# EAGLE design lighthouse-v01 (EAGLE 6.3)
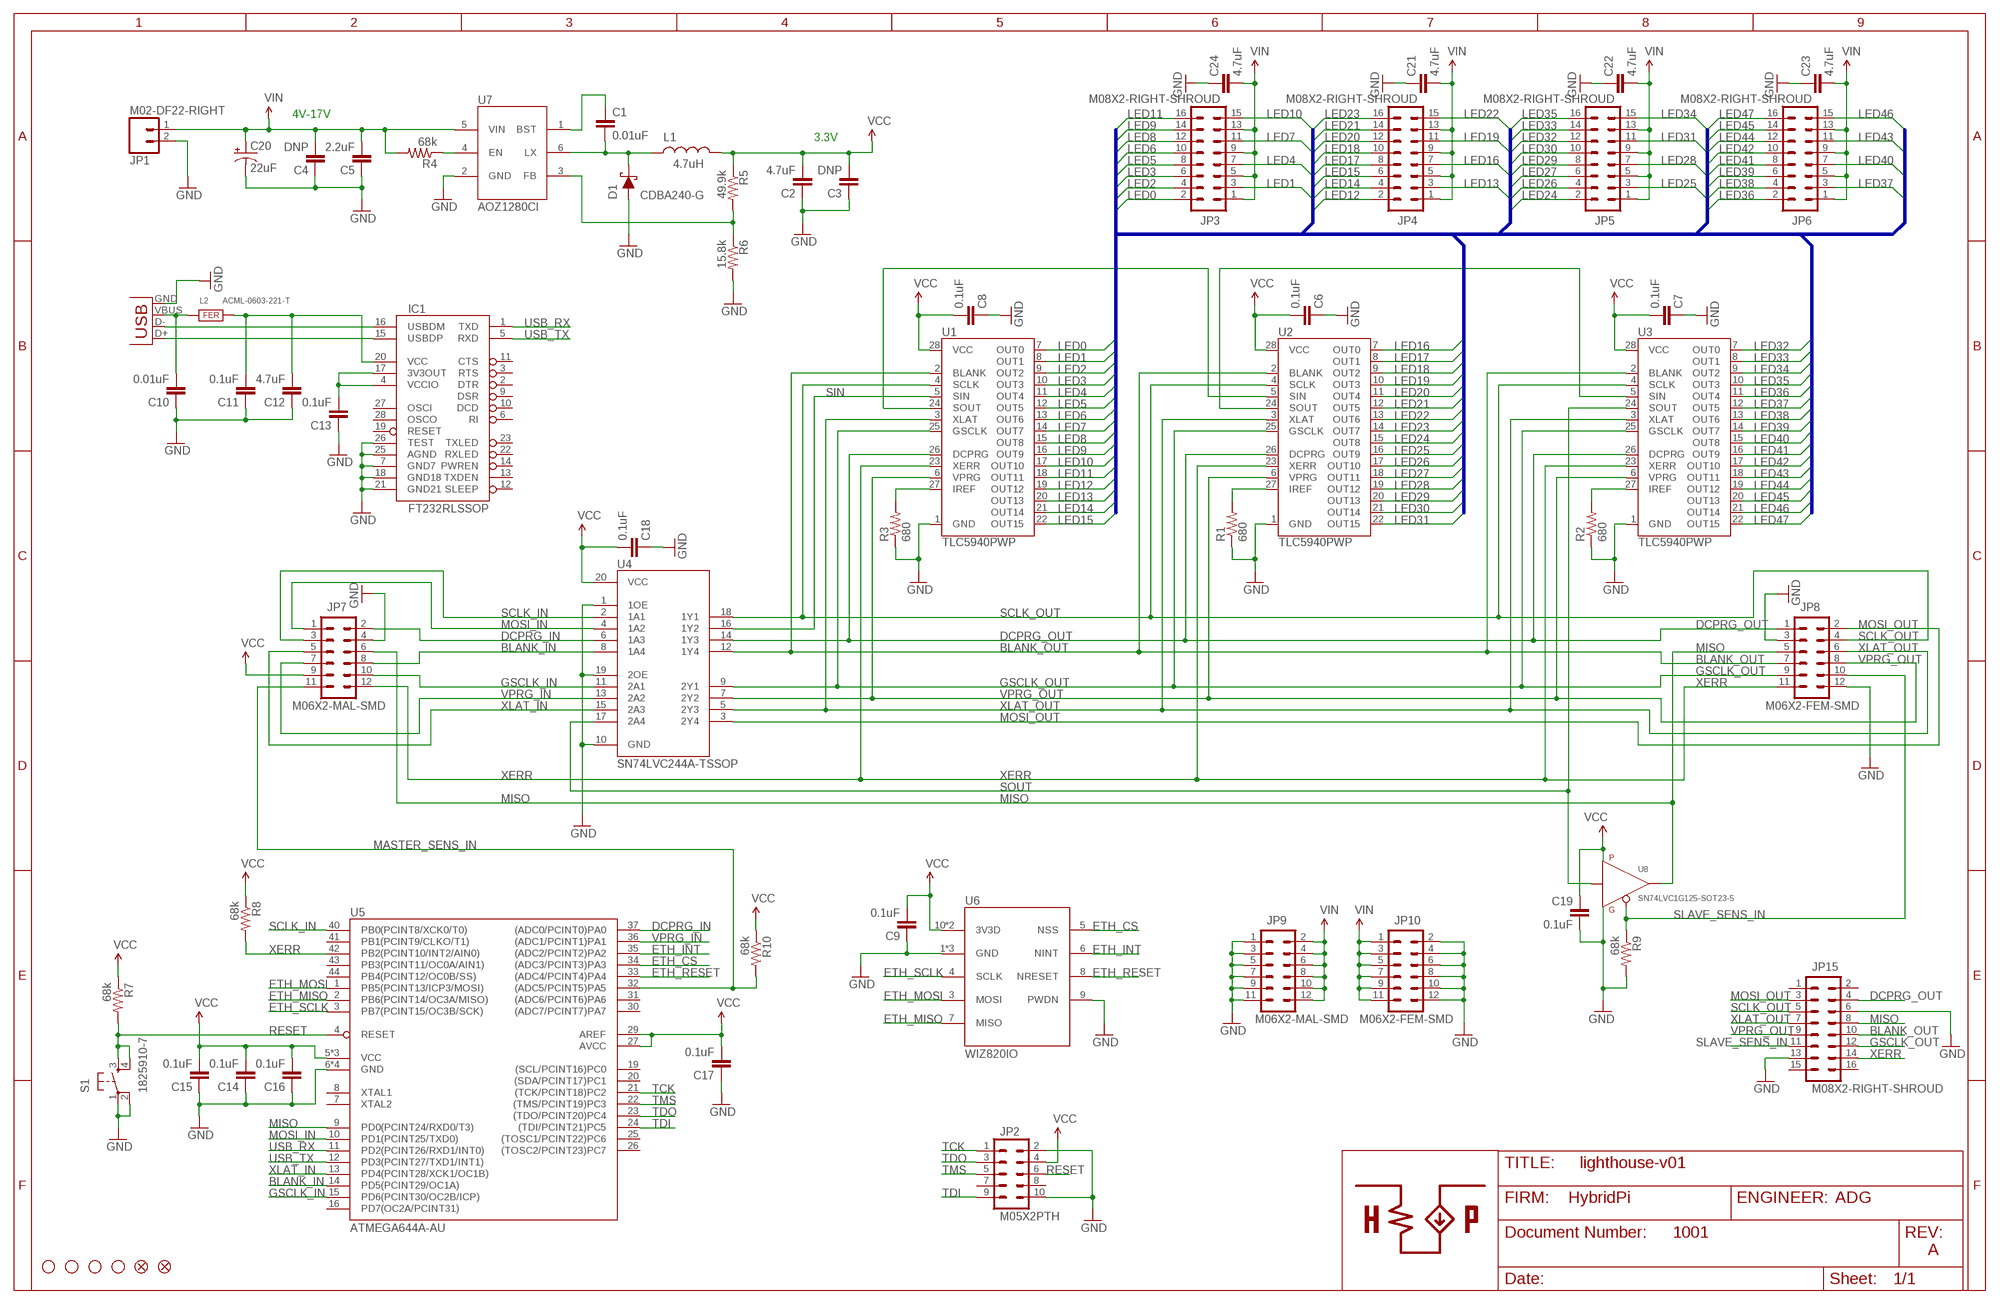
[diagram p0: schematic, sheet 1]

## Parts
C1  0.01uF  CAP0603-CAP  [0603-CAP]
C2  4.7uF  CAP0805  [0805]
C3  DNP  CAP0805  [0805]
C4  DNP  CAP0805  [0805]
C5  2.2uF  CAP0805  [0805]
C6  0.1uF  CAP0603-CAP  [0603-CAP]
C7  0.1uF  CAP0603-CAP  [0603-CAP]
C8  0.1uF  CAP0603-CAP  [0603-CAP]
C9  0.1uF  CAP0603-CAP  [0603-CAP]
C10  0.01uF  CAP0603-CAP  [0603-CAP]
C11  0.1uF  CAP0603-CAP  [0603-CAP]
C12  4.7uF  CAP0805  [0805]
C13  0.1uF  CAP0603-CAP  [0603-CAP]
C14  0.1uF  CAP0603-CAP  [0603-CAP]
C15  0.1uF  CAP0603-CAP  [0603-CAP]
C16  0.1uF  CAP0603-CAP  [0603-CAP]
C17  0.1uF  CAP0603-CAP  [0603-CAP]
C18  0.1uF  CAP0603-CAP  [0603-CAP]
C19  0.1uF  CAP0603-CAP  [0603-CAP]
C20  22uF  CAP_POLF80  [NIPPON_F80]
C21  4.7uF  CAP1206  [1206]
C22  4.7uF  CAP1206  [1206]
C23  4.7uF  CAP1206  [1206]
C24  4.7uF  CAP1206  [1206]
D1  CDBA240-G  DIODE-SCHOTTKY-SMA  [DIODE-SMA]
IC1  FT232RLSSOP  [SSOP28DB]
JP1  M02-DF22-RIGHT  [M02-DF22-RIGHT]
JP2  M05X2PTH  [AVR_ICSP]
JP3  M08X2-RIGHT-SHROUD  [2X8-RIGHT-SHROUD]
JP4  M08X2-RIGHT-SHROUD  [2X8-RIGHT-SHROUD]
JP5  M08X2-RIGHT-SHROUD  [2X8-RIGHT-SHROUD]
JP6  M08X2-RIGHT-SHROUD  [2X8-RIGHT-SHROUD]
JP7  M06X2-MAL-SMD  [2X6-SMD]
JP8  M06X2-FEM-SMD  [2X6-SMD]
JP9  M06X2-MAL-SMD  [2X6-SMD]
JP10  M06X2-FEM-SMD  [2X6-SMD]
JP11  STAND-OFF  [STAND-OFF]
JP12  STAND-OFF  [STAND-OFF]
JP13  STAND-OFF  [STAND-OFF]
JP14  STAND-OFF  [STAND-OFF]
JP15  M08X2-RIGHT-SHROUD  [2X8-RIGHT-SHROUD]
JP16  FIDUCIAL1.5X3  [FIDUCIAL-1.5X3]
JP17  FIDUCIAL1.5X3  [FIDUCIAL-1.5X3]
L1  4.7uH  INDUCTOR-SRN6045  [SRN6045]
L2  ACML-0603-221-T  FERRITE-BEAD-0603  [0603]
R1  680  RESISTOR0603-RES  [0603-RES]
R2  680  RESISTOR0603-RES  [0603-RES]
R3  680  RESISTOR0603-RES  [0603-RES]
R4  68k  RESISTOR0603-RES  [0603-RES]
R5  49.9k  RESISTOR0603-RES  [0603-RES]
R6  15.8k  RESISTOR0603-RES  [0603-RES]
R7  68k  RESISTOR0603-RES  [0603-RES]
R8  68k  RESISTOR0603-RES  [0603-RES]
R9  68k  RESISTOR0603-RES  [0603-RES]
R10  68k  RESISTOR0603-RES  [0603-RES]
S1  1825910-7  TAC_SWITCHPTH  [TACTILE-PTH]
U1  TLC5940PWP  [TSSOP28-GROUNDPAD]
U2  TLC5940PWP  [TSSOP28-GROUNDPAD]
U3  TLC5940PWP  [TSSOP28-GROUNDPAD]
U4  SN74LVC244A-TSSOP  [TSSOP-20]
U5  ATMEGA644A-AU  [TQFP-44]
U6  WIZ820IO  [WIZ820IO]
U7  AOZ1280CI  [SOT23-6]
U8  SN74LVC1G125-SOT23-5  [SOT23-5]
X1  USBSMD  [USB-MINIB]

## Nets
BLANK_IN: JP7.8 U4.8(1A4) U5.14(PD5(PCINT29/OC1A))
BLANK_OUT: JP8.7 JP15.10 U1.2(BLANK) U2.2(BLANK) U3.2(BLANK) U4.12(1Y4)
DCPRG_IN: JP7.2 U4.6(1A3) U5.37((ADC0/PCINT0)PA0)
DCPRG_OUT: JP8.1 JP15.4 U1.26(DCPRG) U2.26(DCPRG) U3.26(DCPRG) U4.14(1Y3)
ETH_CS: U5.34((ADC3/PCINT3)PA3) U6.5(NSS)
ETH_INT: U5.35((ADC2/PCINT2)PA2) U6.6(NINT)
ETH_MISO: U5.2(PB6(PCINT14/OC3A/MISO)) U6.7(MISO)
ETH_MOSI: U5.1(PB5(PCINT13/ICP3/MOSI)) U6.3(MOSI)
ETH_RESET: U5.33((ADC4/PCINT4)PA4) U6.8(NRESET)
ETH_SCLK: U5.3(PB7(PCINT15/OC3B/SCK)) U6.4(SCLK)
GND: C2.1 C3.1 C4.1 C5.1 C6.1 C7.1 C8.1 C9.1 C10.1 C11.1 C12.1 C13.1 C14.1 C15.1 C16.1 C17.1 C18.1 C19.2 C20.- C21.1 C22.1 C23.1 C24.1 D1.A IC1.7(GND7) IC1.18(GND18) IC1.21(GND21) IC1.25(AGND) IC1.26(TEST) JP1.2 JP2.2 JP2.10 JP7.4 JP8.3 JP8.12 JP9.1 JP9.3 JP9.5 JP9.7 JP9.9 JP9.11 JP10.2 JP10.4 JP10.6 JP10.8 JP10.10 JP10.12 JP15.6 JP15.13 R1.1 R2.1 R3.1 R6.2 R9.2 S1.1 S1.2 U1.1(GND) U2.1(GND) U3.1(GND) U4.1(1OE) U4.10(GND) U4.19(2OE) U5.6(GND) U5.18(GND) U5.28(GND) U5.39(GND) U6.1(GND) U6.2(GND) U6.9(PWDN) U6.12(GND) U7.2(GND) U8.3(GND) X1.GND
GSCLK_IN: JP7.10 U4.11(2A1) U5.15(PD6(PCINT30/OC2B/ICP))
GSCLK_OUT: JP8.9 JP15.12 U1.25(GSCLK) U2.25(GSCLK) U3.25(GSCLK) U4.9(2Y1)
LED0: JP3.2 U1.7(OUT0)
LED1: JP3.3 U1.8(OUT1)
LED2: JP3.4 U1.9(OUT2)
LED3: JP3.6 U1.10(OUT3)
LED4: JP3.7 U1.11(OUT4)
LED5: JP3.8 U1.12(OUT5)
LED6: JP3.10 U1.13(OUT6)
LED7: JP3.11 U1.14(OUT7)
LED8: JP3.12 U1.15(OUT8)
LED9: JP3.14 U1.16(OUT9)
LED10: JP3.15 U1.17(OUT10)
LED11: JP3.16 U1.18(OUT11)
LED12: JP4.2 U1.19(OUT12)
LED13: JP4.3 U1.20(OUT13)
LED14: JP4.4 U1.21(OUT14)
LED15: JP4.6 U1.22(OUT15)
LED16: JP4.7 U2.7(OUT0)
LED17: JP4.8 U2.8(OUT1)
LED18: JP4.10 U2.9(OUT2)
LED19: JP4.11 U2.10(OUT3)
LED20: JP4.12 U2.11(OUT4)
LED21: JP4.14 U2.12(OUT5)
LED22: JP4.15 U2.13(OUT6)
LED23: JP4.16 U2.14(OUT7)
LED24: JP5.2 U2.15(OUT8)
LED25: JP5.3 U2.16(OUT9)
LED26: JP5.4 U2.17(OUT10)
LED27: JP5.6 U2.18(OUT11)
LED28: JP5.7 U2.19(OUT12)
LED29: JP5.8 U2.20(OUT13)
LED30: JP5.10 U2.21(OUT14)
LED31: JP5.11 U2.22(OUT15)
LED32: JP5.12 U3.7(OUT0)
LED33: JP5.14 U3.8(OUT1)
LED34: JP5.15 U3.9(OUT2)
LED35: JP5.16 U3.10(OUT3)
LED36: JP6.2 U3.11(OUT4)
LED37: JP6.3 U3.12(OUT5)
LED38: JP6.4 U3.13(OUT6)
LED39: JP6.6 U3.14(OUT7)
LED40: JP6.7 U3.15(OUT8)
LED41: JP6.8 U3.16(OUT9)
LED42: JP6.10 U3.17(OUT10)
LED43: JP6.11 U3.18(OUT11)
LED44: JP6.12 U3.19(OUT12)
LED45: JP6.14 U3.20(OUT13)
LED46: JP6.15 U3.21(OUT14)
LED47: JP6.16 U3.22(OUT15)
MASTER_SENS_IN: JP7.11 R10.2 U5.32((ADC5/PCINT5)PA5)
MISO: JP7.6 JP8.5 JP15.8 U5.9(PD0(PCINT24/RXD0/T3)) U8.4(Y)
MOSI_IN: JP7.1 U4.4(1A2) U5.10(PD1(PCINT25/TXD0))
MOSI_OUT: JP8.2 JP15.3 U4.3(2Y4)
N$1: R3.2 U1.27(IREF)
N$2: R1.2 U2.27(IREF)
N$5: U2.24(SOUT) U3.5(SIN)
N$7: C1.1 U7.1(BST)
N$8: C1.2 D1.C L1.1 U7.6(LX)
N$11: R5.2 R6.1 U7.3(FB)
N$13: R4.1 U7.4(EN)
N$14: C10.2 L2.1 X1.VBUS
N$15: C11.2 C12.2 IC1.20(VCC) L2.2
N$16: IC1.16(USBDM) X1.D-
N$17: IC1.15(USBDP) X1.D+
N$18: C13.2 IC1.4(VCCIO) IC1.17(3V3OUT)
N$19: R2.2 U3.27(IREF)
N$24: U1.24(SOUT) U2.5(SIN)
RESET: JP2.6 R7.2 S1.3 S1.4 U5.4(RESET)
SCLK_IN: JP7.3 U4.2(1A1) U5.40(PB0(PCINT8/XCK0/T0))
SCLK_OUT: JP8.4 JP15.5 U1.4(SCLK) U2.4(SCLK) U3.4(SCLK) U4.18(1Y1)
SIN: U1.5(SIN) U4.16(1Y2)
SLAVE_SENS_IN: JP8.10 JP15.11 R9.1 U8.1(OE)
SOUT: U3.24(SOUT) U4.17(2A4) U8.2(A)
TCK: JP2.1 U5.21((TCK/PCINT18)PC2)
TDI: JP2.9 U5.24((TDI/PCINT21)PC5)
TDO: JP2.3 U5.23((TDO/PCINT20)PC4)
TMS: JP2.5 U5.22((TMS/PCINT19)PC3)
USB_RX: IC1.1(TXD) U5.11(PD2(PCINT26/RXD1/INT0))
USB_TX: IC1.5(RXD) U5.12(PD3(PCINT27/TXD1/INT1))
VCC: C2.2 C3.2 C6.2 C7.2 C8.2 C9.2 C14.2 C15.2 C16.2 C17.2 C18.2 C19.1 JP2.4 JP7.9 L1.2 R5.1 R7.1 R8.1 R10.1 U1.28(VCC) U2.28(VCC) U3.28(VCC) U4.20(VCC) U5.5(VCC) U5.17(VCC) U5.27(AVCC) U5.29(AREF) U5.38(VCC) U6.10(3V3D) U6.11(3V3D) U8.5(VCC)
VIN: C4.2 C5.2 C20.+ C21.2 C22.2 C23.2 C24.2 JP1.1 JP3.1 JP3.5 JP3.9 JP3.13 JP4.1 JP4.5 JP4.9 JP4.13 JP5.1 JP5.5 JP5.9 JP5.13 JP6.1 JP6.5 JP6.9 JP6.13 JP9.2 JP9.4 JP9.6 JP9.8 JP9.10 JP9.12 JP10.1 JP10.3 JP10.5 JP10.7 JP10.9 JP10.11 R4.2 U7.5(VIN)
VPRG_IN: JP7.7 U4.13(2A2) U5.36((ADC1/PCINT1)PA1)
VPRG_OUT: JP8.8 JP15.9 U1.6(VPRG) U2.6(VPRG) U3.6(VPRG) U4.7(2Y2)
XERR: JP7.12 JP8.11 JP15.14 R8.2 U1.23(XERR) U2.23(XERR) U3.23(XERR) U5.42(PB2(PCINT10/INT2/AIN0))
XLAT_IN: JP7.5 U4.15(2A3) U5.13(PD4(PCINT28/XCK1/OC1B))
XLAT_OUT: JP8.6 JP15.7 U1.3(XLAT) U2.3(XLAT) U3.3(XLAT) U4.5(2Y3)
Unconnected: IC1.2(DTR) IC1.3(RTS) IC1.6(RI) IC1.9(DSR) IC1.10(DCD) IC1.11(CTS) IC1.12(SLEEP) IC1.13(TXDEN) IC1.14(PWREN) IC1.19(RESET) IC1.22(RXLED) IC1.23(TXLED) IC1.27(OSCI) IC1.28(OSCO) JP2.7 JP2.8 JP15.1 JP15.2 JP15.15 JP15.16 U5.7(XTAL2) U5.8(XTAL1) U5.16(PD7(OC2A/PCINT31)) U5.19((SCL/PCINT16)PC0) U5.20((SDA/PCINT17)PC1) U5.25((TOSC1/PCINT22)PC6) U5.26((TOSC2/PCINT23)PC7) U5.30((ADC7/PCINT7)PA7) U5.31((ADC6/PCINT6)PA6) U5.41(PB1(PCINT9/CLKO/T1)) U5.43(PB3(PCINT11/OC0A/AIN1)) U5.44(PB4(PCINT12/OC0B/SS))

## Buses
LED[0..47]

## Notes on the sheet
- 4V-17V
- 3.3V
- ADG
- 1001
- A

## Library data of the parts
C1 C6-C11 C13-C19 = SparkFun:CAP: Capacitor Standard 0603 ceramic capacitor, and 0.1" leaded capacitor.; EAGLEUP: C0603
C2-C5 = SparkFun:CAP: Capacitor Standard 0603 ceramic capacitor, and 0.1" leaded capacitor.; EAGLEUP: C0805
C12 = SparkFun-Passives:CAP: Capacitor Standard 0603 ceramic capacitor, and 0.1" leaded capacitor.; EAGLEUP: C0603
C20 = SparkFun-Passives:CAP_POL: Capacitor Polarized These are standard SMD and PTH capacitors. Normally 10uF, 47uF, and 100uF in electrolytic and tantalum varieties. Always verify the external diameter of the through hole cap, it varies with capacity, voltage, and manufacturer. The EIA devices should be standard.; EAGLEUP: CAE-NIPPON-F80
C21-C24 = SparkFun-Passives:CAP: Capacitor Standard 0603 ceramic capacitor, and 0.1" leaded capacitor.; EAGLEUP: C1206
D1 = hybridpi:DIODE-SCHOTTKY: Schottky Diode SMA/B Package Example Datasheet: B1X0(B) <http://www.diodes.com/datasheets/ds13002.pdf>; EAGLEUP: DIODE-SMA
IC1 = SparkFun:FT232RL: USB UART FT232RL 4th Generation USB UART (USB <-> Serial) Controller. Spark Fun Electronics SKU : COM-00650; EAGLEUP: SSOP-28
JP1 = hybridpi:M02: 2 Position Connector DF22-Right 15A: DF22-2P-7.92DS(05) <http://www.hirose.co.jp/cataloge_hp/e68010003.pdf>; EAGLEUP: M02-DF22-RIGHT
JP2 = SparkFun-Connectors:M05X2: Header 5x2 Standard 10-pin dual row 0.1" header. Commonly used with AVR-ISP. Use with Spark Fun Electronics SKU: PRT-00778; EAGLEUP: M05X2
JP3-JP6 JP15 = hybridpi:M08X2: 8x2 0.1" Header M08X2-RIGHT-SHROUD: 302-R165 <http://www.on-shore.com/sites/default/files/manuals/302-rxxx.pdf>; EAGLEUP: M08X2-RIGHT-SHROUD
JP7 JP9 = hybridpi:M06X2: 0.1" Header 6x2 SMD Female Package: NPTC062KFMS-RC <http://www.sullinscorp.com/drawings/103_NPxCxx2KFMx-RC,_10488-G.pdf> SMD Male Package: 15-91-2120 <http://www.molex.com/pdm_docs/sd/015912120_sd.pdf>; EAGLEUP: M06X2-MAL-SMD
JP8 JP10 = hybridpi:M06X2: 0.1" Header 6x2 SMD Female Package: NPTC062KFMS-RC <http://www.sullinscorp.com/drawings/103_NPxCxx2KFMx-RC,_10488-G.pdf> SMD Male Package: 15-91-2120 <http://www.molex.com/pdm_docs/sd/015912120_sd.pdf>; EAGLEUP: M06X2-FEM-SMD
JP11-JP14 = SparkFun-Electromechanical:STAND-OFF: #4 Stand Off This is the mechanical footprint for a #4 phillips button head screw. Use the keepout ring to avoid running the screw head into surrounding components. SKU : PRT-00447
JP16 JP17 = SparkFun-Aesthetics:FIDUCIAL: Fiducial Alignment Points Various fiducial points for machine vision alignment.
L1 = hybridpi:INDUCTOR: Inductor SRN6045: Datasheet <http://www.bourns.com/data/global/pdfs/SRN6045.pdf>; EAGLEUP: SRN6045
L2 = ADG:FERRITE-BEAD
R1-R10 = SparkFun:RESISTOR: Resistor Basic schematic elements and footprints for 0603, 1206, and PTH resistors.; EAGLEUP: R0603
S1 = SparkFun-Electromechanical:TAC_SWITCH: Momentary Switch Button commonly used for reset or general input. Spark Fun Electronics SKU : COM-00097; EAGLEUP: TACTILE-PTH
U1-U3 = SparkFun:TLC5940: TI TLC5940 16-channel LED Driver with Dot Correction and Grayscale PWM Control The TLC5940 is a 16-channel, constant-current sink LED driver. Each channel has an individually adjustable 4096-step grayscale PWM brightness control and a 64-step, constant-current sink (dot correction). The dot correction adjusts the brightness variations between LED channels and other LED drivers. The dot correction data is stored in an integrated EEPROM. Both grayscale control and dot correction are accessible via a serial interface. A single external resistor sets the maximum current value of all 16 channels. Packages: 28-pin HTSSOP 32-pin 5x5mm QFN 28-pin DIP; EAGLEUP: TSSOP-28
U4 = hybridpi:SN74LVC244A: High Speed Tri-State Buffer Texas Instruments Datasheet: SN74LVC244A <http://www.ti.com/lit/ds/symlink/sn74lvc244a.pdf>; EAGLEUP: TSSOP-20
U5 = hybridpi:ATMEGA644A: 8-BIT 20MHz MCU Atmel 32 I/O Datasheet: ATMEGAXX(X)4A(P) <http://www.atmel.com/Images/doc8272.pdf>; EAGLEUP: TQFP-44
U6 = hybridpi:WIZ820IO: Ethernet to SPI Communication Module WIZnet Datasheet: WIZ820io <http://www.wiznet.co.kr/include_Files/Just_Download.asp?PK_NUM=463&file_local_path=ReferenceFiles&file_local_name=WIZ820io_User_Manual_V1.0.pdf>; EAGLEUP: WIZ820IO
U7 = hybridpi:AOZ1280CI: 1.2A Buck Regulator w/Internal Power Switch Datasheet: AOZ1280CI <http://www.aosmd.com/res/data_sheets/AOZ1280CI.pdf>; EAGLEUP: SOT23-6
U8 = hybridpi:SN74LVC1G125: Tri-State Buffer Texas Instruments SOT23-5: 74LVC1G125 <http://www.ti.com/lit/ds/symlink/sn74lvc1g125.pdf>; EAGLEUP: SOT23-5
X1 = SparkFun:USB: USB Connectors USB-B-PTH is fully proven SKU : PRT-00139 USB-miniB is fully proven SKU : PRT-00587 USB-A-PCB is untested. USB-A-H is throughly reviewed, but untested. Spark Fun Electronics SKU : PRT-00437 USB-B-SMT is throughly reviewed, but untested. Needs silkscreen touching up. USB-A-S has not been used/tested USB-MB-H has not been used/tested

## Board
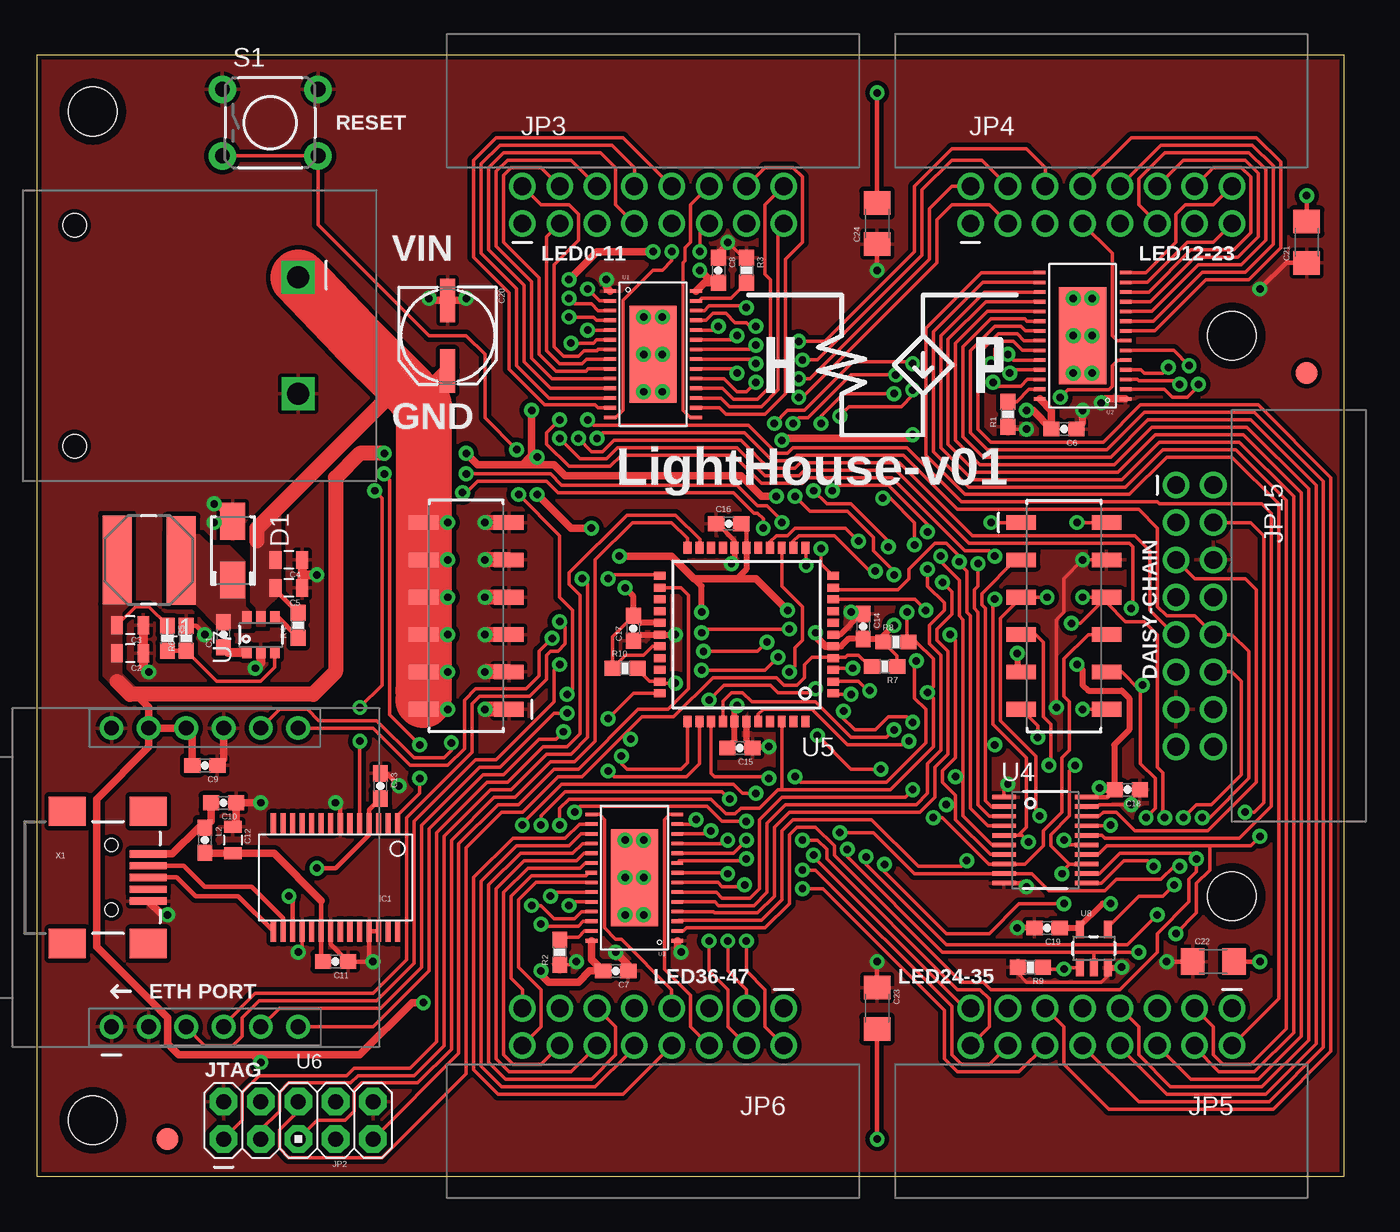
[diagram p1: board, top side]
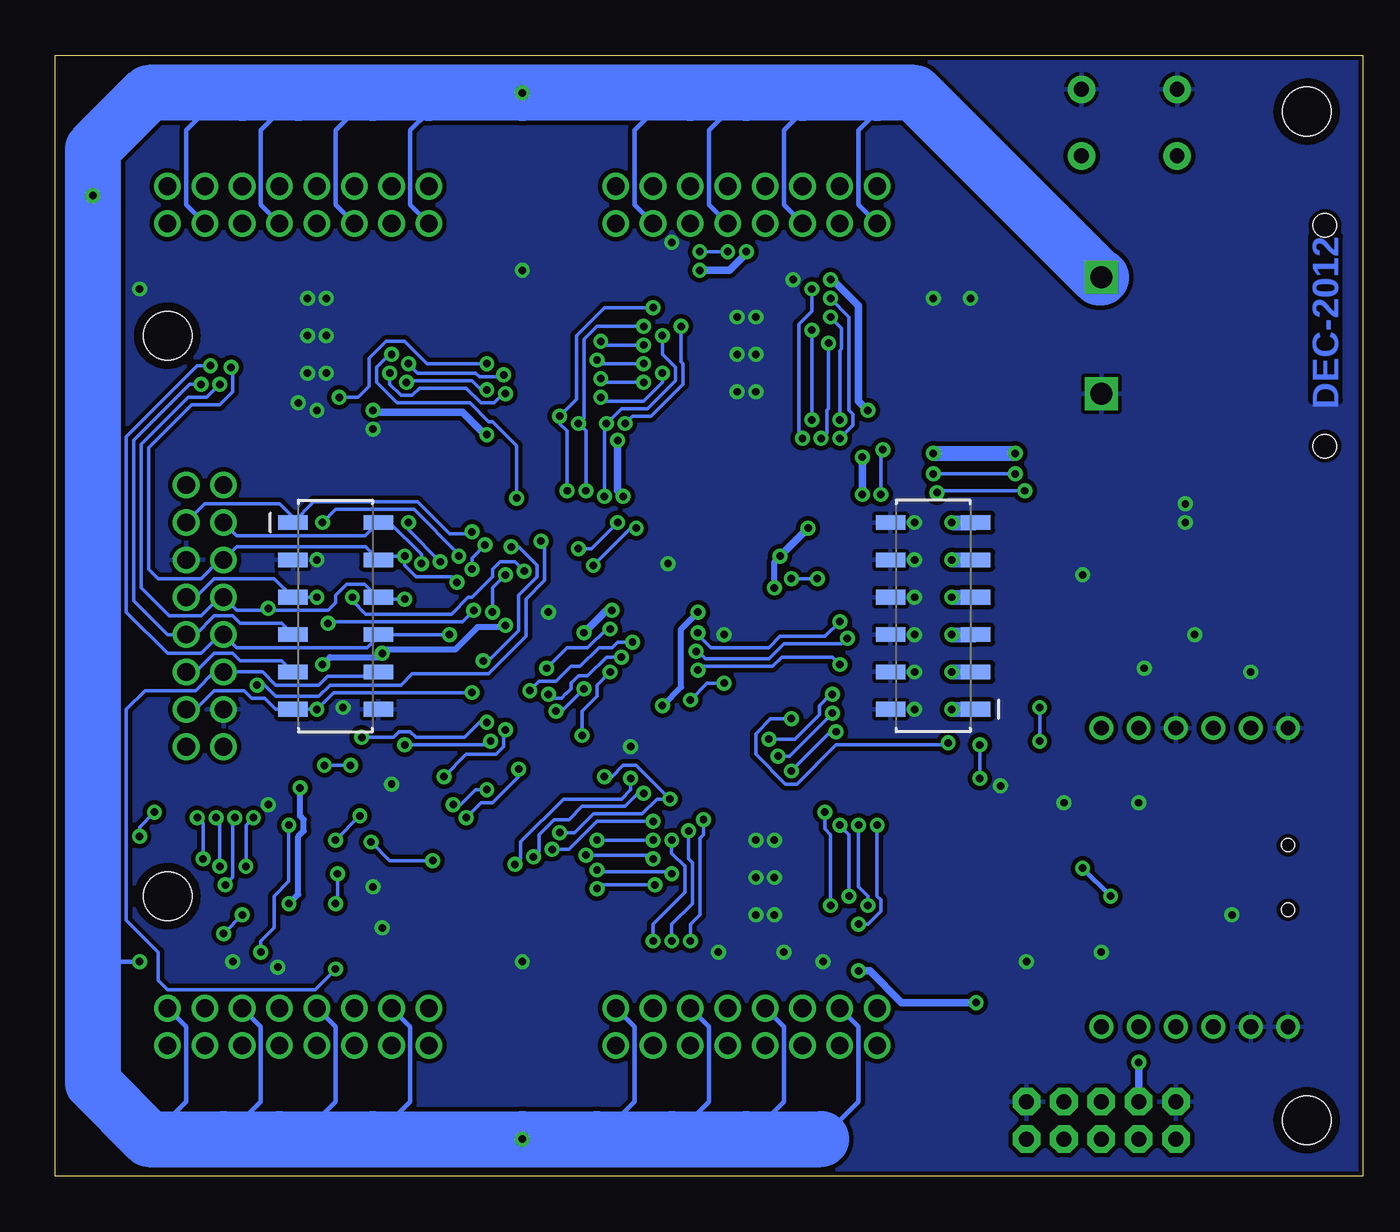
[diagram p2: board, bottom side, seen from below]

Size 88.9 x 76.2 mm. Coordinates in mm from the lower left corner, seen from the top.
Outline: 0,0 88.9,0 88.9,76.2 0,76.2 0,0
Copper layers (1*16): Top 0.035mm / dielectric 1.5mm / Bottom 0.035mm
Design rules "SparkFun": minimum track width 8mil, minimum drill 20mil, track to track 8mil, track to pad 8mil, pad to pad 8mil, via to via 8mil, smd to smd 8mil, copper to edge 10mil, drill to drill 8mil, minimum pad ring 12mil, minimum via ring 10mil, stop-mask expansion 4mil, vias tented up to drill 25mil, thermal gap 10mil

### Footprints (pad centres in the part's own frame; a part is rotated, then mirrored left to right if it is on the bottom)
0603-CAP = smd 1.1 x 1: 1 -0.85,0; 2 0.85,0
0805 = smd 0.8 x 1.2: 1 -0.9,0; 2 0.9,0
NIPPON_F80 = smd 2.95 x 1: + 2.4,0; - -2.4,0
1206 = smd 1.6 x 1.8: 1 -1.4,0; 2 1.4,0
DIODE-SMA = smd 2.5 x 1.7: A -2,0; C 2,0
SSOP28DB = smd 0.348 x 1.397: 1 -4.225,-3.656; 2 -3.575,-3.656; 3 -2.925,-3.656; 4 -2.275,-3.656; 5 -1.625,-3.656; 6 -0.975,-3.656; 7 -0.325,-3.656; 8 0.325,-3.656; 9 0.975,-3.656; 10 1.625,-3.656; 11 2.275,-3.656; 12 2.925,-3.656; 13 3.575,-3.656; 14 4.225,-3.656; 15 4.225,3.656; 16 3.575,3.656; 17 2.925,3.656; 18 2.275,3.656; 19 1.625,3.656; 20 0.975,3.656; 21 0.325,3.656; 22 -0.325,3.656; 23 -0.975,3.656; 24 -1.625,3.656; 25 -2.275,3.656; 26 -2.925,3.656; 27 -3.575,3.656; 28 -4.225,3.656
M02-DF22-RIGHT = drill 1.5 square: 1 3.96,0; 2 -3.96,0 | hole 1.6: -7.5,15.2; 7.5,15.2
AVR_ICSP = drill 1.016 pad 1.88 octagon: 1 -1.27,5.08; 2 1.27,5.08; 3 -1.27,2.54; 4 1.27,2.54; 5 -1.27,0; 6 1.27,0; 7 -1.27,-2.54; 8 1.27,-2.54; 9 -1.27,-5.08; 10 1.27,-5.08
2X8-RIGHT-SHROUD = drill 1.2: 1 -8.89,0; 2 -8.89,2.54; 3 -6.35,0; 4 -6.35,2.54; 5 -3.81,0; 6 -3.81,2.54; 7 -1.27,0; 8 -1.27,2.54; 9 1.27,0; 10 1.27,2.54; 11 3.81,0; 12 3.81,2.54; 13 6.35,0; 14 6.35,2.54; 15 8.89,0; 16 8.89,2.54
2X6-SMD = smd 1 x 2: 1 6.35,2.896; 2 6.35,-2.896; 3 3.81,2.896; 4 3.81,-2.896; 5 1.27,2.896; 6 1.27,-2.896; 7 -1.27,2.896; 8 -1.27,-2.896; 9 -3.81,2.896; 10 -3.81,-2.896; 11 -6.35,2.896; 12 -6.35,-2.896
STAND-OFF = hole 3.302: 0,0
FIDUCIAL-1.5X3 = smd 1.5 x 1.5: 1 0,0
SRN6045 = smd 2 x 6: 1 -2.2,0.05; 2 2.15,0
0603 = smd 1.1 x 1: 1 -0.85,0; 2 0.85,0
0603-RES = smd 1.1 x 1: 1 -0.85,0; 2 0.85,0
TACTILE-PTH = drill 1.016 pad 1.88: 1 -3.251,2.261; 2 3.251,2.261; 3 -3.251,-2.261; 4 3.251,-2.261
TSSOP28-GROUNDPAD = smd 0.8 x 0.25: 1 -2.921,4.298; 2 -2.921,3.637; 3 -2.921,2.977; 4 -2.921,2.317; 5 -2.921,1.656; 6 -2.921,0.996; 7 -2.921,0.335; 8 -2.927,-0.325; 9 -2.921,-0.985; 10 -2.921,-1.646; 11 -2.921,-2.306; 12 -2.921,-2.967; 13 -2.921,-3.627; 14 -2.921,-4.287; 15 2.921,-4.287; 16 2.921,-3.627; 17 2.921,-2.967; 18 2.921,-2.306; 19 2.921,-1.646; 20 2.921,-0.985; 21 2.927,-0.325; 22 2.921,0.335; 23 2.921,0.996; 24 2.921,1.656; 25 2.921,2.317; 26 2.921,2.977; 27 2.921,3.637; 28 2.921,4.298 | smd 3.2 x 6.6: 29 0,0.005
TSSOP-20 = smd 0.3 x 1.6: 1 -2.925,-2.8; 2 -2.275,-2.8; 3 -1.625,-2.8; 4 -0.975,-2.8; 5 -0.325,-2.8; 6 0.325,-2.8; 7 0.975,-2.8; 8 1.625,-2.8; 9 2.275,-2.8; 10 2.925,-2.8; 11 2.925,2.8; 12 2.275,2.8; 13 1.625,2.8; 14 0.975,2.8; 15 0.325,2.8; 16 -0.325,2.8; 17 -0.975,2.8; 18 -1.625,2.8; 19 -2.275,2.8; 20 -2.925,2.8
TQFP-44 = smd 0.8 x 0.54: 1 -5.9,4; 2 -5.9,3.2; 3 -5.9,2.4; 4 -5.9,1.6; 5 -5.9,0.8; 6 -5.9,0; 7 -5.9,-0.8; 8 -5.9,-1.6; 9 -5.9,-2.4; 10 -5.9,-3.2; 11 -5.9,-4; 23 5.9,-4; 24 5.9,-3.2; 25 5.9,-2.4; 26 5.9,-1.6; 27 5.9,-0.8; 28 5.9,0; 29 5.9,0.8; 30 5.9,1.6; 31 5.9,2.4; 32 5.9,3.2; 33 5.9,4 | smd 0.54 x 0.8: 12 -4,-5.9; 13 -3.2,-5.9; 14 -2.4,-5.9; 15 -1.6,-5.9; 16 -0.8,-5.9; 17 0,-5.9; 18 0.8,-5.9; 19 1.6,-5.9; 20 2.4,-5.9; 21 3.2,-5.9; 22 4,-5.9; 34 4,5.9; 35 3.2,5.9; 36 2.4,5.9; 37 1.6,5.9; 38 0.8,5.9; 39 0,5.9; 40 -0.8,5.9; 41 -1.6,5.9; 42 -2.4,5.9; 43 -3.2,5.9; 44 -4,5.9
WIZ820IO = drill 1.016: 1 -10.16,6.35; 2 -10.16,3.81; 3 -10.16,1.27; 4 -10.16,-1.27; 5 -10.16,-3.81; 6 -10.16,-6.35; 7 10.16,-6.35; 8 10.16,-3.81; 9 10.16,-1.27; 10 10.16,1.27; 11 10.16,3.81; 12 10.16,6.35
SOT23-6 = smd 0.63 x 0.8: 1 -0.95,-1.2; 2 0,-1.2; 3 0.95,-1.2; 4 0.95,1.2; 5 0,1.2; 6 -0.95,1.2
SOT23-5 = smd 0.55 x 1.2: 1 -0.95,-1.3; 2 0,-1.3; 3 0.95,-1.3; 4 0.95,1.3; 5 -0.95,1.3
USB-MINIB = smd 2.5 x 0.5: D+ 2.5,0; D- 2.5,0.8; GND 2.5,-1.6; ID 2.5,-0.8; VBUS 2.5,1.6 | smd 2.5 x 2: MTN1 -3,4.5; MTN2 2.5,4.5; MTN3 -3,-4.5; MTN4 2.5,-4.5 | hole 0.9: 0,2.2; 0,-2.2

### Placement (x,y rotation side)
C1  12.7,36.83 90 top
C2  6.35,35.56 180 top
C3  6.35,37.47 180 top
C4  17.14,41.91 180 top
C5  17.14,40.01 180 top
C6  69.85,50.8 180 top
C7  39.37,13.97 180 top
C8  46.35,61.59 270 top
C9  11.43,27.94 180 top
C10  12.7,25.4 180 top
C11  20.32,14.61 180 top
C12  13.34,22.86 270 top
C13  23.37,26.54 270 top
C14  56.2,37.38 270 top
C15  47.82,29.13 180 top
C16  47.05,44.37 0 top
C17  40.58,37.26 90 top
C18  74.17,26.29 180 top
C19  68.71,16.89 180 top
C20  27.94,57.15 270 top
C21  86.36,63.5 90 top
C22  80.01,14.61 0 top
C23  57.15,11.43 270 top
C24  57.15,64.77 90 top
D1  13.34,42.55 270 top
IC1  20.32,20.32 180 top
JP1  17.78,57.15 90 top
JP2  17.78,3.81 90 top
JP3  41.91,64.77 0 top
JP4  72.39,64.77 0 top
JP5  72.39,11.43 180 top
JP6  41.91,11.43 180 top
JP7  69.85,38.1 90 top
JP8  69.85,38.1 90 bottom
JP9  29.21,38.1 270 top
JP10  29.21,38.1 270 bottom
JP11  81.28,57.15 0 top
JP12  81.28,19.05 0 top
JP13  3.81,3.81 0 top
JP14  3.81,72.39 0 top
JP15  77.47,38.1 270 top
JP16  8.89,2.54 0 top
JP17  86.36,54.61 0 top
L1  7.62,41.91 180 top
L2  11.43,22.86 270 top
R1  66.04,51.82 90 top
R2  35.56,15.24 90 top
R3  48.26,61.59 270 top
R4  17.78,37.47 90 top
R5  8.89,36.58 270 top
R6  10.16,36.58 90 top
R7  57.66,34.67 180 top
R8  58.42,36.32 0 top
R9  67.56,14.22 180 top
R10  40.01,34.54 0 top
S1  15.88,71.63 0 top
U1  41.91,55.88 0 top
U2  71.12,57.15 180 top
U3  40.64,20.32 180 top
U4  68.58,22.86 270 top
U5  48.26,36.83 180 top
U6  11.43,20.32 90 top
U7  15.24,36.83 0 top
U8  71.88,15.49 0 top
U$9  [HYBRIDPI_LOGO_MED]  48.26,50.29 0 top
X1  5.08,20.32 0 top

### Tracks (layer width: path | path; a pad name or v marks a point on that pad's centre or on a via)
BLANK_IN  (via drill 0.51)
  Top 0.254: JP7.8 71.5,36.83 69.85,35.18 69.85,32.64 70.23,32.26 70.23,28.96 69.72,28.45 69.72,24.77 68.45,23.5 68.45,22.48 67.21,21.23 U4.8 64.74,21.23 61.59,24.38 v60.96,24.38 | v53.09,29.97 55.37,27.69 v57.4,27.69 | U5.14 50.67,42.72 50.67,40.13 52.07,38.73 52.07,36.45 51.56,35.94 51.56,34.67 v51.18,34.29
  Bottom 0.254: v51.18,34.29 52.07,33.4 52.07,32.64 53.09,31.62 v53.09,29.97 | v60.96,24.38 59.94,25.4 59.18,25.4 57.4,27.18 v57.4,27.69
BLANK_OUT  (via drill 0.51)
  Top 0.254: U1.2 38.27,59.52 v37.47,60.33 | U3.2 43.99,16.68 44.2,16.89 49.53,16.89 51.18,18.54 51.18,23.24 51.69,23.75 52.96,23.75 54.23,22.48 54.23,21.84 62.87,13.21 64.39,13.21 64.9,12.7 73.66,12.7 76.2,15.24 76.2,16.51 78.36,18.67 78.36,20.19 78.87,20.7 v78.87,21.59 78.49,21.97 73.66,21.97 72.27,20.59 U4.12 | U2.2 76.66,53.51 77.22,52.96 78.23,52.96 78.99,53.72 v78.99,53.85 | v38.1,50.16 38.48,50.55 48.13,50.55 50.04,48.64 51.31,48.64 51.69,49.02 58.93,49.02 62.61,45.34 74.93,45.34 76.2,44.07 76.2,38.73 76.83,38.1 78.74,38.1 JP15.10 81.28,36.83 82.42,35.69 82.42,27.05 79.76,24.38 v79.25,24.38
  Bottom 0.254: v37.47,60.33 37.47,58.8 38.35,57.91 38.35,50.42 v38.1,50.16 | v78.99,53.85 79.76,53.85 83.57,50.04 83.57,39.12 81.28,36.83 JP15.10 79.38,36.83 78.11,38.1 76.83,38.1 76.33,37.59 73.51,37.59 JP8.7 | v78.87,21.59 78.87,24 v79.25,24.38
DCPRG_IN  (via drill 0.51)
  Top 0.254: v70.74,44.45 JP7.2 | U4.6 64.97,22.54 62.99,24.51 62.99,27.18 | 62.99,27.18 62.99,37.85 62.74,38.1 62.74,40.51 61.47,41.78 v61.47,42.16 | v62.48,27.18 62.99,27.18 | v58.29,30.35 57.78,29.84 55.37,29.84 52.96,32.26 48.64,32.26 48.01,32.89 47.24,32.89 46.66,32.31 U5.37
  Bottom 0.254: v70.74,44.45 69.85,45.34 64.52,45.34 61.47,42.29 v61.47,42.16 | v62.48,27.18 60.96,28.7 58.93,28.7 58.42,29.21 58.42,30.23 v58.29,30.35
DCPRG_OUT  (via drill 0.51)
  Top 0.254: U1.26 45.4,58.86 45.72,59.18 48.13,59.18 v48.26,59.05 | U3.26 37.16,17.34 36.83,17.02 34.42,17.02 v34.29,17.14 | U2.26 67.38,54.17 66.93,53.72 65.28,53.72 v65.02,53.98 | v59.56,53.47 59.56,53.09 58.8,52.32 55.24,52.32 v54.61,51.69 | U4.14 72.18,21.89 72.77,22.48 79.76,22.48 | 79.76,22.48 82.55,22.48 v83.19,23.11 | v82.17,24.77 82.8,24.77 83.44,25.4 83.44,43.56 82.55,44.45 JP15.4 | v33.02,23.88 33.02,24 35.69,26.67 47.37,26.67 48.01,26.04 v48.9,26.04 | 79.76,22.48 79.76,20.83 78.87,19.94 78.87,17.91 v77.47,16.51 | v56.39,21.72 56.39,21.21 61.85,15.75 74.17,15.75 v76.2,17.78 | v54.1,46.61 54.1,46.74 54.36,46.99 57.91,46.99 60.71,44.2 60.71,43.94 v60.58,43.81
  Bottom 0.254: v48.26,59.05 51.56,59.05 53.47,57.15 53.47,52.83 v54.61,51.69 54.61,51.18 54.1,50.67 v54.1,46.61 | v34.29,17.14 33.66,17.14 32.77,18.03 32.77,18.8 33.02,19.05 v33.02,23.88 | v65.02,53.98 64.9,54.1 60.58,54.1 59.94,53.47 v59.56,53.47 | JP15.4 78.74,45.72 73.66,45.72 72.75,44.81 JP8.1 71.35,45.85 64.26,45.85 62.1,43.69 60.71,43.69 v60.58,43.81 | v48.9,26.04 49.28,26.04 50.16,25.15 53.09,25.15 53.98,24.26 54.99,24.26 56.01,23.24 56.01,22.1 v56.39,21.72 | v76.2,17.78 v77.47,16.51 | v83.19,23.11 83.19,23.75 v82.17,24.77
ETH_CS  (via drill 0.51 pad 0.41)
  Top 0.254: U6.5 16.51,11.43 23.37,11.43 26.16,14.22 26.16,23.88 30.1,27.81 31.5,27.81 35.18,31.5 v36.07,31.5 35.81,31.5 | U5.34 44.26,28.13 43.81,27.69 40.13,27.69 39.75,28.07 v39.75,28.57
  Bottom 0.254: v36.07,31.5 38.99,28.57 v39.75,28.57
ETH_INT  (via drill 0.51 pad 0.41)
  Top 0.254: U6.6 22.86,10.16 26.67,13.97 26.67,23.62 30.35,27.3 31.75,27.3 34.16,29.72 35.31,29.72 v35.81,30.23 | v38.86,27.56 39.24,27.18 44.2,27.18 45.06,28.04 U5.35
  Bottom 0.254: v35.81,30.23 36.2,30.23 v38.86,27.56
ETH_MISO  (via drill 0.51 pad 0.41)
  Top 0.254: U6.7 22.86,30.48 25.4,27.94 27.94,27.94 29.08,29.08 29.08,32.38 29.84,33.15 33.27,33.15 34.16,34.04 34.16,35.69 v35.05,36.58 | v56.64,33.02 56.52,33.02 55.88,33.66 54.19,33.66 U5.2 | v45.34,35.69 49.02,35.69 v49.66,36.32
  Bottom 0.254: v56.64,33.02 56.01,33.66 54.86,33.66 53.85,34.67 53.21,34.67 51.94,35.94 51.05,35.94 50.67,36.32 v49.66,36.32 | v45.34,35.69 45.21,35.69 44.7,35.18 40.39,35.18 39.37,36.2 35.43,36.2 v35.05,36.58
ETH_MOSI  (via drill 0.51 pad 0.41)
  Top 0.254: U6.3 11.43,8.89 13.34,8.89 13.97,9.53 13.97,10.79 15.11,11.94 23.11,11.94 25.65,14.48 25.65,24.13 29.84,28.32 31.24,28.32 35.18,32.26 35.18,34.42 v35.56,34.8 | v55.37,32.77 54.22,32.77 U5.1 | v45.21,34.42 49.53,34.42 v50.42,35.31
  Bottom 0.254: v55.37,32.77 55.12,32.51 54.48,32.51 U5.1 53.85,33.14 53.85,33.53 53.34,34.04 52.7,34.04 51.44,35.31 v50.42,35.31 | v45.21,34.42 44.96,34.67 40.13,34.67 39.5,35.31 36.07,35.31 v35.56,34.8
ETH_RESET  (via drill 0.51 pad 0.41)
  Top 0.254: U6.8 16.51,31.75 18.41,31.75 19.18,30.99 23.11,30.99 25.65,28.45 27.69,28.45 28.19,28.96 v28.19,29.46 | v38.86,31.11 40.58,32.83 U5.33
  Bottom 0.254: v28.19,29.46 28.32,29.34 35.81,29.34 38.48,26.67 39.24,26.67 41.27,28.7 41.27,30.1 40.26,31.11 v38.86,31.11
ETH_SCLK  (via drill 0.51 pad 0.41)
  Top 0.254: U6.4 12.7,10.29 14.86,12.45 22.86,12.45 25.15,14.73 25.15,24.38 29.59,28.83 29.59,32.13 30.1,32.64 33.53,32.64 34.67,33.78 34.67,35.43 34.92,35.69 35.43,35.69 35.94,36.2 35.94,37.34 v35.56,37.72 | v51.18,37.21 45.47,37.21 v45.21,36.96 | U5.3 54.17,34.42 54.3,34.54 v55.5,34.54
  Bottom 0.254: v45.21,36.96 45.21,36.83 44.32,35.94 40.39,35.94 39.62,36.7 36.58,36.7 v35.56,37.72 | v55.5,34.54 54.1,35.94 52.7,35.94 51.44,37.21 v51.18,37.21
GND  (via drill 0.51, 0.51 pad 0.41)
  Top 0.254: R3.1 48.05,62.45 v46.99,63.5 | 35.56,13.97 R2.1 36.49,14.39 v36.7,14.61 | R1.1 66.21,50.8 v67.31,50.8 | U4.19 72.12,25.14 72.26,25.27 74,25.27 | 74,25.27 C18.1 | U4.1 65.78,26.41 v66.04,26.67 | R9.2 66.71,13.8 67.31,13.21 72.39,13.21 72.83,13.65 U8.3 | JP8.3 v71.12,41.91 69.85,40.64 69.85,38.35 69.34,37.85 v69.34,31.88 | v74.42,25.27 74,25.27 | IC1.18 18.05,15.51 v17.78,15.24
  Top 0.305: R6.2 10.83,37.43 v11.43,36.83 | IC1.7 20.64,25.07 v20.32,25.4 | IC1.21 20,15.78 C11.1 v22.86,14.61 22.59,14.87 IC1.25 IC1.26 | C24.1 v57.15,61.59 | C23.1 v57.15,14.61 | C8.1 46.35,62.87 v46.99,63.5 | C22.1 v76.83,14.61 | C21.1 84.96,62.1 v83.19,60.33 | U4.10 67.06,19.93 v67.31,19.68 | C13.1 23.79,27.39 v24.64,26.54 | U5.18 47.46,43.22 46.31,44.37
  Top 0.406: U8.3 73.76,14.19 v73.79,14.22 | C19.2 v66.67,16.89 | C15.1 48.26,29.53 U5.39 48.26,29.59 48.64,29.21 v49.78,29.21 | C17.1 41,36.83 U5.28 v43.43,36.83 | U5.6 54.61,36.83 56.01,38.23 C14.1 56.08,38.35 v55.37,38.35 | U5.18 47.46,41.87 v47.24,41.66 | 46.31,44.37 C16.1 | v12.06,44.45 13.46,44.45 | 13.46,44.45 13.97,44.45 | v12.06,45.72 12.19,45.72 13.46,44.45
  Top 0.508: C12.1 13.55,23.98 C10.1 v15.24,25.4 | X1.GND 8.52,17.78 v8.89,17.78 | U1.1 38.73,60.43 v38.73,60.96 | C20.- 29.07,59.55 29.08,59.56 | v29.21,59.69 29.08,59.56 | 29.08,59.56 26.8,59.56 v26.67,59.69 | U3.1 43.56,15.49 v43.81,15.24 | C7.1 40.22,14.39 v39.37,15.24 | C6.1 71.12,51.22 v71.12,52.07 | U2.1 72.66,52.85 v72.39,52.58 | C9.1 12.7,28.36 U6.9
  Top 0.61: C3.1 C2.1 7.25,34.66 v7.62,34.29 | C4.1 C5.1 18.05,40.89 v19.05,40.89 | U7.2 15.24,34.92 v14.86,34.54
  Top 1.016: JP10.12 v30.48,44.45 | JP10.10 v30.48,41.91 | JP10.8 v30.48,39.37 | JP10.6 v30.48,36.83 | JP10.4 v30.48,34.29 | JP10.2 v30.48,31.75
  other vias: 42.55,58.42 41.27,55.88 42.55,55.88 41.27,53.34 42.55,53.34 41.27,22.86 40.01,22.86 40.01,20.32 41.27,20.32 41.27,17.78 40.01,17.78 41.27,58.42 71.75,59.69 70.48,59.69 70.48,57.15 71.75,57.15 70.48,54.61 71.75,54.61
  pour Bottom (isolate 0.305, rank 6): 0,76.2 88.9,76.2 88.9,0 0,0
  pour Top (isolate 0.305, rank 6): 0,76.2 88.9,76.2 88.9,0 0,0
GSCLK_IN  (via drill 0.51, 0.51 pad 0.41)
  Top 0.254: U4.11 72.39,19.93 73.91,21.46 75.56,21.46 v75.95,21.08 | v75.44,24.38 76.07,25.02 76.07,27.05 75.06,28.07 75.06,33.02 74.99,33.08 | 74.99,33.08 73.79,34.29 JP7.10 | v75.18,33.4 75.18,33.27 74.99,33.08 | U5.15 49.86,43.13 50.29,43.56 51.05,43.56 51.56,44.07 54.99,44.07 v55.88,43.18
  Bottom 0.254: v75.44,24.38 75.95,23.88 v75.95,21.08 | v55.88,43.18 55.63,42.93 55.63,40.51 56.9,39.24 56.9,36.7 59.44,34.16 64.64,34.16 65.41,33.4 70.23,33.4 70.99,32.64 73.91,32.64 74.68,33.4 v75.18,33.4
GSCLK_OUT  (via drill 0.51, 0.51 pad 0.41)
  Top 0.254: U1.25 45.5,58.2 45.97,58.67 46.86,58.67 47.5,58.04 48.26,58.04 48.51,57.78 v48.9,57.78 | U3.25 37.05,18 36.58,17.53 35.18,17.53 34.29,18.41 v33.66,18.41 | U2.25 66.39,54.83 v66.17,54.61 | v58.29,53.21 54.86,53.21 53.34,51.69 v53.34,51.18 | v77.98,24.38 78.87,25.27 79.88,25.27 81.92,27.3 81.92,33.66 81.28,34.29 JP15.12 | v34.29,23.88 34.29,24.51 35.94,26.16 46.61,26.16 v47.12,25.65 | v54.61,23.37 56.9,23.37 59.68,20.59 U4.9 67.68,20.59 68.83,19.43 72.64,19.43 73.41,20.19 76.45,20.19 77.34,21.08 v77.72,21.08 | v52.83,46.61 53.72,45.72 55.37,45.72 57.91,43.18 v57.91,42.8 | v51.56,27.18 51.94,26.8 57.78,26.8 60.45,29.46 60.45,31.75 59.69,32.51 59.69,34.92 v59.82,35.05
  Bottom 0.254: v48.9,57.78 52.07,57.78 52.96,56.9 52.96,51.56 v53.34,51.18 52.83,50.67 v52.83,46.61 | v33.66,18.41 33.66,19.05 34.29,19.68 v34.29,23.88 | v66.17,54.61 66.17,53.85 65.41,53.09 64.64,53.09 64.14,53.59 60.96,53.59 59.94,52.58 59.05,52.58 58.42,53.21 v58.29,53.21 | JP15.12 79.38,34.29 78.11,35.56 76.83,35.56 76.33,35.05 73.51,35.05 JP8.9 | v77.72,21.08 77.72,24.13 v77.98,24.38 | v54.61,23.37 53.59,23.37 52.32,24.64 49.02,24.64 48.01,25.65 v47.12,25.65 49.4,27.94 50.29,27.94 51.05,27.18 v51.56,27.18 | v57.91,42.8 57.4,42.8 56.13,41.53 56.13,40.77 57.4,39.5 57.4,37.08 59.44,35.05 v59.82,35.05
LED0
  Top 0.254: JP3.2 34.29,66.04 36.2,66.04 36.83,65.41 36.83,63.63 35.18,61.98 35.18,56.39 35.81,55.75 36.83,55.75 37.21,56.13 38.1,56.13 38.18,56.22 U1.7
LED1
  Top 0.254: U1.8 37.39,55.55 37.08,55.24 35.56,55.24 34.67,56.13 34.67,63.88 JP3.3
LED2
  Top 0.254: U1.9 37.5,54.9 37.34,54.74 35.31,54.74 34.16,55.88 34.16,61.09 31.75,63.5 31.75,68.07 32.26,68.58 34.29,68.58 JP3.4
LED3
  Top 0.254: U1.10 35.05,54.23 33.66,55.63 33.66,60.83 31.24,63.25 31.24,68.33 32,69.09 36.32,69.09 JP3.6
LED4
  Top 0.254: U1.11 34.95,53.57 33.15,55.37 33.15,60.58 30.73,62.99 30.73,68.58 31.75,69.6 38.35,69.6 39.37,68.58 39.37,66.04 JP3.7
LED5
  Top 0.254: U1.12 34.84,52.91 32.64,55.12 32.64,60.33 30.23,62.74 30.23,68.83 31.5,70.1 39.12,70.1 40.64,68.58 JP3.8
LED6
  Top 0.254: JP3.10 39.88,70.61 31.24,70.61 29.72,69.09 29.72,62.48 32.13,60.07 32.13,54.86 34.54,52.45 37.97,52.45 38.17,52.25 U1.13
LED7  (via drill 0.51)
  Top 0.254: U1.14 39.4,51.59 39.88,52.07 39.88,59.56 41.91,61.59 42.55,61.59 43.18,62.23 v43.18,62.87 | v45.09,62.87 45.09,64.14 JP3.11
  Bottom 0.254: v43.18,62.87 v45.09,62.87
LED8
  Top 0.254: U1.15 44.42,51.59 43.94,52.07 43.94,62.1 44.07,62.23 44.07,63.12 44.45,63.5 44.45,66.04 JP3.12
LED9
  Top 0.254: JP3.14 49.53,68.58 51.44,68.58 52.07,67.94 52.07,63.5 50.93,62.36 50.93,53.21 49.53,51.82 46.86,51.82 46.43,52.25 U1.16
LED10
  Top 0.254: JP3.15 50.42,64.39 50.42,53.47 49.28,52.32 47.12,52.32 46.53,52.91 U1.17
LED11
  Top 0.254: JP3.16 49.53,66.04 49.53,61.34 49.91,60.96 49.91,53.72 49.02,52.83 47.37,52.83 46.63,53.57 U1.18
LED12  (via drill 0.51)
  Top 0.254: U1.19 46.73,54.23 47.62,53.34 48.26,53.34 v48.9,53.98 | JP4.2 62.23,67.31 60.71,65.79 60.71,62.36 52.58,54.23 v51.82,54.23
  Bottom 0.254: v48.9,53.98 51.56,53.98 v51.82,54.23
LED13  (via drill 0.51)
  Top 0.254: U1.20 47.34,54.9 v47.62,54.61 | JP4.3 64.77,66.04 62.23,66.04 61.21,65.02 61.21,62.1 52.07,52.96 v51.82,52.96
  Bottom 0.254: v47.62,54.61 47.62,53.98 48.9,52.7 51.56,52.7 v51.82,52.96
LED14  (via drill 0.51)
  Top 0.254: U1.21 48.59,55.55 v48.9,55.24 | JP4.4 64.26,69.09 62.23,69.09 60.2,67.06 60.2,62.61 53.09,55.5 v52.07,55.5
  Bottom 0.254: v48.9,55.24 51.82,55.24 v52.07,55.5
LED15  (via drill 0.51)
  Top 0.254: U1.22 48.59,56.22 v48.9,56.52 | JP4.6 68.58,68.58 67.31,69.85 62.23,69.85 59.69,67.31 59.69,62.87 53.59,56.77 v51.82,56.77
  Bottom 0.254: v48.9,56.52 51.56,56.52 v51.82,56.77
LED16
  Top 0.254: U2.7 73.49,56.81 73.15,57.15 73.15,62.74 JP4.7
LED17
  Top 0.254: U2.8 76.02,57.48 79.5,60.96 82.42,60.96 84.58,63.12 84.58,68.96 82.93,70.61 74.42,70.61 JP4.8
LED18
  Top 0.254: U2.9 75.92,58.13 79.25,61.47 82.17,61.47 84.07,63.37 84.07,68.71 82.68,70.1 76.45,70.1 JP4.10
LED19
  Top 0.254: U2.10 75.81,58.8 78.99,61.98 81.92,61.98 83.57,63.63 83.57,68.45 82.42,69.6 76.71,69.6 74.93,67.82 74.93,66.04 JP4.11
LED20
  Top 0.254: U2.11 75.71,59.46 78.74,62.48 81.66,62.48 83.06,63.88 83.06,68.2 82.17,69.09 77.98,69.09 JP4.12
LED21
  Top 0.254: U2.12 75.61,60.12 78.49,62.99 81.41,62.99 82.55,64.14 82.55,67.94 81.92,68.58 80.01,68.58 JP4.14
LED22
  Top 0.254: U2.13 75.51,60.78 78.23,63.5 80.01,63.5 JP4.15
LED23
  Top 0.254: U2.14 75.41,61.44 77.47,63.5 77.47,65.41 78.11,66.04 80.01,66.04 JP4.16
LED24
  Top 0.254: U2.15 64.23,61.44 60.45,57.66 60.45,49.02 63.12,46.35 74.3,46.35 76.83,48.9 81.28,48.9 84.45,45.72 84.45,12.06 JP5.2
LED25
  Top 0.254: U2.16 64.33,60.78 60.96,57.4 60.96,49.28 63.37,46.86 74.04,46.86 76.58,49.4 81.53,49.4 84.96,45.97 84.96,10.03 82.55,7.62 80.64,7.62 80.01,8.26 80.01,10.16 JP5.3
LED26
  Top 0.254: U2.17 64.44,60.12 61.47,57.15 61.47,49.53 63.63,47.37 73.79,47.37 76.33,49.91 81.79,49.91 85.47,46.23 85.47,9.78 82.8,7.11 80.39,7.11 78.74,8.76 JP5.4
LED27
  Top 0.254: U2.18 64.54,59.46 61.98,56.9 61.98,49.78 63.88,47.88 73.53,47.88 76.07,50.42 82.04,50.42 85.98,46.48 85.98,9.53 83.06,6.6 78.49,6.6 JP5.6
LED28
  Top 0.254: U2.19 64.64,58.8 62.48,56.64 62.48,50.04 64.14,48.39 73.28,48.39 75.82,50.93 82.3,50.93 86.49,46.74 86.49,9.27 83.31,6.1 77.09,6.1 74.93,8.26 74.93,10.16 JP5.7
LED29
  Top 0.254: U2.20 67.34,58.13 67.18,58.29 64.9,58.29 62.99,56.39 62.99,50.29 64.39,48.9 73.03,48.9 75.56,51.44 82.55,51.44 87,46.99 87,9.02 83.57,5.59 76.83,5.59 73.66,8.76 JP5.8
LED30
  Top 0.254: U2.21 67.24,57.48 66.93,57.78 65.15,57.78 63.5,56.13 63.5,50.55 64.64,49.4 72.77,49.4 75.31,51.94 82.8,51.94 87.5,47.24 87.5,8.76 83.82,5.08 74.93,5.08 JP5.10
LED31
  Top 0.254: U2.22 67.14,56.81 66.67,57.28 65.41,57.28 64.01,55.88 64.01,50.8 64.9,49.91 72.52,49.91 75.06,52.45 83.06,52.45 88.01,47.5 88.01,8.51 84.07,4.57 72.9,4.57 69.85,7.62 69.85,10.16 JP5.11
LED32  (via drill 0.51)
  Top 0.254: JP5.12 66.8,7.11 62.61,7.11 61.72,8 61.72,11.3 53.47,19.56 v52.07,19.56 | U3.7 46.31,19.98 46.61,19.68 48.01,19.68 v48.13,19.81
  Bottom 0.254: v48.13,19.81 51.82,19.81 v52.07,19.56
LED33  (via drill 0.51)
  Top 0.254: JP5.14 64.77,7.62 62.87,7.62 62.23,8.26 62.23,11.56 52.96,20.83 v52.07,20.83 | U3.8 46.92,20.64 v46.99,20.57
  Bottom 0.254: v46.99,20.57 47.12,20.7 51.94,20.7 v52.07,20.83
LED34  (via drill 0.51)
  Top 0.254: JP5.15 63.12,11.43 52.83,21.72 v52.83,21.84 | U3.9 43.56,21.34 43.69,21.46 48.13,21.46 v48.26,21.59
  Bottom 0.254: v48.26,21.59 48.51,21.84 v52.83,21.84
LED35  (via drill 0.51)
  Top 0.254: JP5.16 64.77,10.16 64.77,12.06 64.14,12.7 62.61,12.7 53.72,21.59 53.72,22.23 53.09,22.86 v52.07,22.86 | U3.10 47.37,21.97 v48.26,22.86
  Bottom 0.254: v48.26,22.86 v52.07,22.86
LED36  (via drill 0.51)
  Top 0.254: U3.11 46.76,22.63 v46.99,22.86 | v48.26,16 48.26,13.97 49.53,12.7 49.53,10.16 JP6.2
  Bottom 0.254: v46.99,22.86 46.99,21.97 46.1,21.08 46.1,19.3 48.26,17.14 v48.26,16
LED37  (via drill 0.51)
  Top 0.254: U3.12 45.64,23.29 v45.85,23.5 | v46.99,16 46.99,13.97 48.26,12.7 JP6.3
  Bottom 0.254: v45.85,23.5 45.85,21.59 45.59,21.34 45.59,18.54 46.99,17.14 v46.99,16
LED38  (via drill 0.51)
  Top 0.254: U3.13 44.52,23.95 v44.83,24.26 | v45.72,16 45.72,13.97 46.99,12.7 46.99,10.16 JP6.4
  Bottom 0.254: v44.83,24.26 44.83,23.24 45.09,22.99 45.09,17.78 45.72,17.14 v45.72,16
LED39
  Top 0.254: U3.14 43.02,24.61 42.67,24.26 42.67,14.1 44.45,12.32 44.45,10.16 JP6.6
LED40
  Top 0.254: U3.15 38.26,24.61 38.61,24.26 38.61,16.89 39.37,16.13 39.75,16.13 43.18,12.7 JP6.7
LED41
  Top 0.254: U3.16 36.9,23.95 35.94,22.99 32.38,22.99 29.72,20.32 29.72,7.24 31.37,5.59 39.88,5.59 JP6.8
LED42
  Top 0.254: U3.17 37,23.29 36.2,22.48 32.64,22.48 30.23,20.07 30.23,7.49 31.62,6.1 37.97,6.1 40.26,8.38 40.26,8.51 JP6.10
LED43
  Top 0.254: U3.18 37.1,22.63 36.45,21.97 32.89,21.97 30.73,19.81 30.73,7.75 31.88,6.6 37.72,6.6 39.37,8.26 39.37,10.16 JP6.11
LED44
  Top 0.254: U3.19 37.21,21.97 36.7,21.46 33.15,21.46 31.24,19.56 31.24,8 32.13,7.11 36.32,7.11 JP6.12
LED45
  Top 0.254: U3.20 37.31,21.3 36.96,20.95 33.4,20.95 31.75,19.3 31.75,8.26 32.38,7.62 34.29,7.62 JP6.14
LED46
  Top 0.254: U3.21 37.54,20.64 37.34,20.45 33.66,20.45 32.26,19.05 32.26,13.46 33.02,12.7 JP6.15
LED47
  Top 0.254: U3.22 33.95,19.98 32.77,18.8 32.77,14.22 34.29,12.7 34.29,10.16 JP6.16
MASTER_SENS_IN  (via drill 0.51)
  Top 0.254: v43.43,33.53 42.46,33.53 U5.32 42.34,33.66 41.66,33.66 40.85,34.46 R10.2 | v68.07,29.84 68.07,30.63 JP7.11 | v54.86,31.62 54.74,31.5 54.74,31.24 55.63,30.35 57.02,30.35 57.91,31.24 59.18,31.24 v59.56,30.86 | v45.72,32.38 46.74,33.4 49.91,33.4 50.42,32.89 52.7,32.89 v52.96,33.15
  Bottom 0.254: v68.07,29.84 65.91,29.84 65.53,30.23 64.77,30.23 64.39,29.84 61.09,29.84 60.07,30.86 v59.56,30.86 | v52.96,33.15 54.48,31.62 v54.86,31.62 | v43.43,33.53 44.58,33.53 v45.72,32.38
MISO  (via drill 0.51)
  Top 0.254: v71.12,39.37 JP8.5 72.38,39 | v60.45,38.48 59.7,39.23 U5.9 | 72.38,39 70.97,37.59 v70.36,37.59 | U8.4 72.83,16.95 74.93,19.05 76.58,19.05 v77.34,19.81 | 72.38,39 72.76,39 74.04,37.72 75.31,37.72 76.2,36.83 76.2,27.81 76.58,27.43 76.58,24.51 v76.71,24.38
  Bottom 0.254: JP15.8 79.38,39.37 78.11,40.64 74.02,40.64 JP8.5 v71.12,39.37 | v60.45,38.48 61.21,37.72 70.23,37.72 v70.36,37.59 | v77.34,19.81 76.83,20.32 76.83,24.26 v76.71,24.38
MOSI_IN  (via drill 0.51)
  Top 0.254: U4.4 64.68,23.84 63.5,25.02 63.5,38.1 63.25,38.35 63.25,41.15 62.74,41.66 v62.74,41.78 62.74,42.16 61.85,43.05 61.09,43.05 59.31,41.27 59.31,40.64 58.55,39.88 54.31,39.88 U5.10 | v64.9,44.45 JP7.1
  Bottom 0.254: v62.74,41.78 64.9,43.94 v64.9,44.45
MOSI_OUT  (via drill 0.51)
  Top 0.254: U4.3 64.8,24.48 64.01,25.27 64.01,38.35 63.75,38.61 63.75,39.88 64.01,40.13 v64.01,41.66
  Bottom 0.254: JP15.3 76.58,43.56 67.84,43.56 JP8.2 66.17,44.45 64.01,42.29 v64.01,41.66
N$1
  Top 0.254: U1.27 45.04,59.52 45.21,59.69 47.2,59.69 R3.2
N$2
  Top 0.254: U2.27 67.48,53.51 66.64,52.67 R1.2
N$5  (via drill 0.51)
  Top 0.254: U3.5 46.11,18.66 46.35,18.41 48.77,18.41 49.66,19.3 49.66,24 50.93,25.27 59.82,25.27 60.58,26.04 60.58,28.07 61.47,28.96 61.47,35.43 60.71,36.2 60.71,37.47 61.72,38.48 61.72,38.99 60.58,40.13 v60.58,41.27 | U2.24 66.43,55.49 v66.04,55.88 | v57.53,46.1 58.04,46.1 59.69,44.45 v59.69,42.93
  Bottom 0.254: v66.04,55.88 66.17,55.88 67.06,54.99 67.06,53.98 65.66,52.58 60.71,52.58 59.44,51.31 59.18,51.31 57.53,49.66 v57.53,46.1 | v59.69,42.93 60.58,42.04 v60.58,41.27
N$7
  Top 0.61: C1.1 13.05,35.63 U7.1
N$8
  pour Top (isolate 0.305, no thermals): 14.48,37.34 14.48,38.35 14.1,38.73 14.1,41.78 13.08,42.8 12.06,42.8 11.81,42.8 11.05,43.56 8.89,43.56 8.89,38.99 10.79,38.99 12.32,37.47 12.32,37.34
N$11
  Top 0.254: R6.1 12.23,33.66 15.24,33.66 16.19,34.6 U7.3
  Top 0.305: R5.2 R6.1
N$13
  Top 0.305: R4.1 16.36,38.03 U7.4
N$14
  Top 0.254: L2.1 11.85,24.13
  Top 0.508: X1.VBUS 9.22,21.92 11.01,23.71 L2.1 | 11.85,24.13 C10.2
N$15
  Top 0.305: 19.34,18.75 IC1.20 19.34,14.73 C11.2
  Top 0.508: L2.2 11.48,21.96 C12.2 16.14,21.96 19.34,18.75
N$16
  Top 0.305: X1.D- 9.99,21.12 11.43,19.68 14.61,19.68 16.75,17.55 IC1.16
N$17
  Top 0.305: X1.D+ 9.53,20.32 10.79,19.05 13.71,19.05 IC1.15
N$18  (via drill 0.51)
  Top 0.305: IC1.17 17.39,18.66 v17.14,19.05 | v19.05,20.95 20.32,20.95 22.59,23.23 IC1.4 22.59,24.92 C13.2
  Bottom 0.305: v17.14,19.05 v19.05,20.95
N$19
  Top 0.254: U3.27 37.26,16.68 36.83,16.26 35.73,16.26 R2.2
N$24  (via drill 0.51)
  Top 0.254: U1.24 46.11,57.54 v46.35,57.78 | U2.5 73.53,55.49 73.15,55.12 73.15,53.72 72.9,53.47 70.1,53.47 v69.6,52.96 | v50.16,51.18 51.05,52.07 52.2,52.07 55.5,55.37 59.44,55.37 v59.56,55.24
  Bottom 0.254: v46.35,57.78 46.35,55.37 46.23,55.24 46.23,53.85 48.39,51.69 49.66,51.69 v50.16,51.18 | v69.6,52.96 68.33,52.96 67.56,53.72 67.56,55.63 66.42,56.77 65.15,56.77 63.63,55.24 v59.56,55.24
RESET  (via drill 0.51)
  Top 0.254: JP2.6 17.78,4.45 16.51,3.17 16.51,1.91 17.14,1.27 23.5,1.27 29.21,6.99 29.21,22.35 31.62,24.77 33.02,24.77 35.43,27.18 37.08,27.18 40.01,30.1 | 40.01,30.1 41.15,31.24 43.31,31.24 45.97,33.91 50.29,33.91 50.8,33.4 51.69,33.4 52.2,33.91 52.2,34.8 52.7,35.31 54.08,35.31 U5.4 54.24,35.31 54.99,35.31 55.12,35.43 55.88,35.43 56.64,34.67 R7.2 | S1.3 S1.4 19.13,64.69 26.67,57.15 29.21,57.15 30.48,55.88 30.48,51.56 v32.64,49.4 | v32.77,46.35 35.56,43.56 35.56,39.37 36.45,38.48 36.45,33.15 v36.07,32.77 | v40.39,29.72 40.01,30.1
  Bottom 0.254: v32.77,46.35 32.77,49.28 v32.64,49.4 | v40.39,29.72 38.61,29.72 36.96,31.37 36.96,32 36.2,32.77 v36.07,32.77
SCLK_IN  (via drill 0.51)
  Top 0.254: U4.2 64.91,25.14 64.52,25.53 64.52,29.34 | 64.52,29.34 64.52,38.61 64.26,38.86 64.26,39.62 66.55,41.91 JP7.3 | U5.40 49.06,31.41 49.4,31.75 52.7,31.75 55.12,29.34 59.05,29.34 v59.31,29.59 | v65.15,29.34 64.52,29.34
  Bottom 0.254: v65.15,29.34 59.56,29.34 v59.31,29.59
SCLK_OUT  (via drill 0.51)
  Top 0.254: U1.4 38.07,58.2 37.85,58.42 v36.2,58.42 | U3.4 46.01,18 46.1,17.91 49.02,17.91 50.16,19.05 50.16,23.75 51.18,24.77 60.07,24.77 61.09,25.78 61.09,27.81 61.98,28.7 61.98,35.69 61.21,36.45 61.21,37.21 62.23,38.23 62.23,39.75 v61.59,40.39 | U2.4 75.09,54.83 75.31,54.61 76.58,54.61 v76.96,54.99 | v35.56,51.44 34.67,50.55 34.67,49.78 36.2,48.26 38.99,48.26 39.75,49.02 47.37,49.02 49.28,47.12 52.07,47.12 52.45,47.5 58.17,47.5 63.12,42.55 64.77,42.55 v65.15,42.16 | U4.18 72.24,24.48 72.52,24.77 73.41,24.77 74.68,23.5 79.63,23.5 82.93,26.8 82.93,39.88 82.17,40.64 78.74,40.64 JP15.5
  Bottom 0.254: v36.2,58.42 35.43,57.66 35.43,56.26 35.56,56.13 v35.56,51.44 | v76.96,54.99 76.83,54.86 76.83,53.34 77.72,52.45 79.63,52.45 82.55,49.53 82.55,41.27 81.92,40.64 78.99,40.64 77.72,41.91 JP15.5 76.58,42.8 67.82,42.8 66.95,41.94 JP8.4 arc90 66.7,42.16 v65.15,42.16 65.15,41.53 64.39,40.77 61.98,40.77 v61.59,40.39
SIN  (via drill 0.51)
  Top 0.254: U1.5 v37.47,57.54 v37.47,57.53 | v37.47,51.44 37.85,51.05 48.39,51.05 50.29,49.15 51.05,49.15 51.44,49.53 59.18,49.53 62.87,45.85 76.2,45.85 76.33,45.72 83.31,45.72 83.95,45.09 83.95,25.15 81.79,22.99 72.64,22.99 72.45,23.18 U4.16
  Bottom 0.254: v37.47,57.53 v37.47,51.44
SLAVE_SENS_IN  (via drill 0.51)
  Top 0.254: U8.1 70.07,14.19 69.98,14.1 v69.85,14.1 68.8,14.1 68.67,13.97 R9.1
  Bottom 0.254: JP8.10 66.95,34.01 70.38,34.01 70.99,33.4 73.91,33.4 74.8,34.29 JP15.11 78.11,34.29 79.38,33.02 82.8,33.02 84.07,31.75 84.07,17.4 81.92,15.24 81.92,13.34 81.28,12.7 71.25,12.7 v69.85,14.1
SOUT  (via drill 0.51)
  Top 0.254: U3.24 36.44,18.66 v36.2,18.41 | U4.17 72.98,23.84 v73.03,23.88 | v36.58,24.77 36.96,25.15 45.59,25.15 46.61,24.13 v48.26,24.13 | v55.12,22.23 55.12,21.72 61.59,15.24 71.88,15.24 | 71.88,15.24 v74.93,15.24 | U8.2 71.88,15.24
  Bottom 0.254: v36.2,18.41 36.2,23.24 36.58,23.62 v36.58,24.77 | v73.03,23.88 73.03,20.07 74.04,19.05 74.04,16.89 74.93,16 v74.93,15.24 | v48.26,24.13 52.07,24.13 53.98,22.23 v55.12,22.23
TCK
  Top 0.254: JP2.1 13.97,3.81 13.97,5.71 15.11,6.86 21.08,6.86 21.59,7.37 25.4,7.37 27.18,9.14 27.18,23.37 30.61,26.8 32,26.8 34.42,29.21 36.07,29.21 36.96,30.1 36.96,39.5 36.2,40.26 36.2,41.02 40.13,44.96 43.43,44.96 45.09,43.31 45.09,42.76 U5.21
TDI
  Top 0.254: JP2.9 28.7,8.38 28.7,22.61 31.37,25.27 32.77,25.27 35.18,27.69 36.83,27.69 40.89,31.75 42.93,31.75 44.32,33.15 44.32,39.5 43.81,40.01 42.38,40.01 U5.24
TDO  (via drill 0.51)
  Top 0.254: JP2.3 15.24,3.17 16.51,4.45 16.51,5.71 17.14,6.35 21.34,6.35 21.84,6.86 25.65,6.86 27.69,8.89 27.69,23.11 30.86,26.29 32.26,26.29 34.67,28.7 36.32,28.7 37.47,29.84 37.47,40.26 v37.08,40.64 | v38.86,40.64 39.12,40.89 42.3,40.89 U5.23
  Bottom 0.254: v37.08,40.64 v38.86,40.64
TMS
  Top 0.254: JP2.5 19.05,3.81 20.95,3.81 21.59,4.45 21.59,5.84 22.1,6.35 25.91,6.35 28.19,8.64 28.19,22.86 31.11,25.78 32.51,25.78 34.92,28.19 36.58,28.19 37.97,29.59 37.97,41.91 40.51,44.45 43.18,44.45 44.26,43.37 U5.22
USB_RX  (via drill 0.51 pad 0.41)
  Top 0.254: IC1.1 24.55,24.55 26.04,26.04 v26.04,27.05 | v26.04,29.34 24,31.37 24,47.37 v23.62,47.75 | v53.34,42.67 53.34,41.65 U5.11 | v29.21,47.75 34.92,47.75 35.69,46.99 47.62,46.99 49.02,45.59 49.66,45.59 50.67,44.58 v50.67,44.45
  Bottom 0.254: v26.04,27.05 v26.04,29.34 | v23.62,47.75 v29.21,47.75 | v50.67,44.45 52.45,42.67 v53.34,42.67
USB_TX  (via drill 0.51 pad 0.41)
  Top 0.254: IC1.5 21.95,29.57 v21.97,29.59 | 52.2,42.67 U5.12 52.32,42.67 v52.32,41.53 | v21.97,31.88 23.5,33.4 23.5,46.1 v22.99,46.61 | v28.96,46.48 29.21,46.48 29.97,47.24 34.67,47.24 35.43,46.48 47.37,46.48 48.77,45.09 49.02,45.09 49.4,44.7 v49.4,44.07
  Bottom 0.254: v21.97,29.59 v21.97,31.88 | v28.96,46.48 28.83,46.61 v22.99,46.61 | v49.4,44.07 49.78,44.07 v52.32,41.53
VCC  (via drill 0.51)
  Top 0.254: R5.1 8.89,37.47 7.62,38.73 6.72,38.73 C3.2 | 57.87,36.28 R8.1 | R8.1 58.51,35.38 R7.1 | 57.57,36.74 R8.1 | U5.29 41.87,36.03 41.27,35.43 40.04,35.43 R10.1 39.16,36.69 C17.2
  Top 0.305: U4.20 72.81,25.79 C18.2 | U5.17 48.26,44.01 C16.2
  Top 0.406: C8.2 45.94,60.74 | v58.29,37.47 57.57,36.74 | C19.1 70.83,16.89 | 70.83,16.89 U8.5 | v70.74,34.8 71.12,34.42 71.12,33.4 71.5,33.02 73.79,33.02 74.3,32.51 74.3,30.35 73.28,29.34 73.28,26.33 C18.2 72.39,26.29 v72.26,26.42 | 70.83,16.89 72.49,18.54 v73.03,18.54 | C15.2 47.46,29.62 U5.38 47.46,31.84 v47.62,32 | U5.27 41.05,37.63 C17.2 40.58,39.43 v40.01,40.01 | U5.5 54.7,36.03 55.24,36.58 56.15,36.58 C14.2 57.36,36.53 R8.1 | v45.21,38.35 45.21,40.13 44.7,40.64 | U5.17 48.26,41.27 47.62,40.64 | v66.67,35.56 66.67,34.57 JP7.9
  Top 0.508: 45.94,60.74 v45.09,61.59 | v41.91,62.87 38.1,62.87 v36.2,60.96 | U3.28 37.72,14.77 | 37.72,14.77 C7.2 | U1.28 45.4,60.74 C8.2 | 37.72,14.77 37.72,14.73 38.48,13.97 37.59,13.97 36.83,13.21 34.8,13.21 34.29,13.72 v34.29,13.97 | U2.28 69,52.05 C6.2 67.73,52.07 v67.31,52.07 | U5.5 53.63,36.03 52.96,36.7 v52.96,36.96 | v51.05,38.48 48.9,40.64 47.62,40.64 44.7,40.64 43.18,42.16 v39.62,42.16 | v33.66,52.07 33.66,49.02 33.53,48.9 | v59.56,50.42 59.31,50.16 50.8,50.16 v50.67,50.04 | v50.29,46.23 49.28,46.23 47.88,47.62 35.94,47.62 35.18,48.39 33.02,48.39 | 33.02,48.39 29.97,48.39 v29.21,49.15 | v37.72,44.07 36.32,44.07 v34.04,46.35 | v34.04,48.9 33.53,48.9 | 33.53,48.9 33.02,48.39 | v26.29,11.81 25.53,11.81 21.97,8.26 14.73,8.26 | 14.73,8.26 9.65,8.26 8.89,9.02 8.89,10.79 4.06,15.62 4.06,25.65 7.62,29.21 U6.11 | v15.24,7.75 14.73,8.26 | U6.11 U6.10 10.58,30.06 C9.2 | U6.11 7.62,31.88 6.67,32.83
  Top 1.016: v23.62,49.15 21.97,49.15 20.32,47.5 20.32,34.29 18.8,32.77 6.35,32.77 5.46,33.66
  Bottom 0.406: 41.91,62.74 v41.91,62.87 | v58.29,37.47 58.42,37.34 60.2,37.34 61.72,35.81 66.42,35.81 v66.67,35.56 66.93,35.31 70.23,35.31 v70.74,34.8 | v73.03,18.54 72.39,19.18 72.39,23.11 72.01,23.5 72.01,24.26 72.26,24.51 v72.26,26.42 | v47.62,32 46.35,33.27 46.35,37.21 v45.21,38.35 | v40.01,40.01 40.01,41.78 v39.62,42.16
  Bottom 0.508: v45.09,61.59 43.05,61.59 41.91,62.74 | v36.2,60.96 36.07,60.96 34.29,59.18 34.29,52.7 v33.66,52.07 | v67.31,52.07 67.18,51.94 61.21,51.94 59.69,50.42 v59.56,50.42 | JP2.4 v15.24,7.75 | v52.96,36.96 51.44,38.48 v51.05,38.48 | v39.62,42.16 v37.72,44.07 | v34.04,46.35 v34.04,48.9 | v50.67,50.04 50.67,46.61 v50.29,46.23 | v34.29,13.97 33.53,13.97 31.37,11.81 v26.29,11.81
  Bottom 1.016: v29.21,49.15 v23.62,49.15
  pour Top (isolate 0.305, no thermals): 4.57,44.83 6.35,44.83 6.35,38.99 5.71,38.35 5.71,34.42 5.71,34.29 5.71,34.16 6.99,32.89 6.99,32.51 6.1,32.51 4.57,34.04
VIN  (via drill 0.51)
  Top 0.254: JP10.11 JP10.9 JP10.7 JP10.5 JP10.3 JP10.1 26.29,31.77 26.29,33.02
  Top 0.305: R4.2 16.25,39.85 C5.2 | C24.2 v57.15,73.66 | C23.2 v57.15,2.54 | C22.2 v83.19,14.61 | C21.2 v86.36,66.67
  Top 0.508: JP10.7 26.31,52.43 24.83,53.91 17.78,60.96
  Top 1.016: JP10.7 v27.94,39.37 | JP10.5 v27.94,36.83 | JP10.3 v27.94,34.29 | JP10.1 v27.94,31.75 | JP10.9 v27.94,41.91 | JP10.11 v27.94,44.45 | C20.+ 26.04,52.84 26.04,52.7 | 14.99,43.18 14.99,44.07 24.83,53.91
  Top 3.81: JP1.1 21.59,57.15 24.83,53.91 26.04,52.7 26.31,52.43 26.29,52.4 26.29,33.02 26.29,32.38
  Bottom 0.305: JP3.1 34.29,66.04 34.29,71.12 33.02,72.39 33.02,73.66 | JP3.5 39.37,66.04 39.37,71.12 38.1,72.39 38.1,73.66 | JP3.9 44.45,66.04 44.45,71.12 41.91,73.66 | JP3.13 49.53,66.04 49.53,71.12 46.99,73.66 45.72,73.66 | JP4.1 64.77,66.04 64.77,71.12 63.5,72.39 63.5,73.66 | JP4.5 69.85,66.04 69.85,71.12 67.31,73.66 | JP4.9 74.93,66.04 74.93,71.12 72.39,73.66 | JP4.13 80.01,66.04 80.01,71.12 77.47,73.66 76.2,73.66 | JP5.1 80.01,10.16 80.01,5.08 82.55,2.54 | JP5.5 74.93,10.16 74.93,5.08 77.47,2.54 | JP5.9 69.85,10.16 69.85,5.08 72.39,2.54 73.66,2.54 | JP5.13 64.77,10.16 64.77,5.08 67.31,2.54 | JP6.1 49.53,10.16 49.53,5.08 52.07,2.54 | JP6.5 44.45,10.16 44.45,5.08 46.99,2.54 | JP6.9 39.37,10.16 39.37,5.08 41.91,2.54 | JP6.13 34.29,10.16 34.29,5.08 36.83,2.54 | 85.98,15.24 86.36,14.86 | v83.19,14.61 86.23,14.61 86.36,14.48
  Bottom 1.016: v27.94,44.45 JP10.11 | v27.94,41.91 JP10.9 | v27.94,39.37 JP10.7 | v27.94,36.83 JP10.5 | v27.94,34.29 JP10.3 | v27.94,31.75 JP10.1
  Bottom 3.81: JP1.1 17.93,61.11 30.48,73.66 33.02,73.66 38.1,73.66 41.91,73.66 45.72,73.66 v57.15,73.66 63.5,73.66 67.31,73.66 72.39,73.66 76.2,73.66 82.55,73.66 86.36,69.85 v86.36,66.67 86.36,14.86 86.36,14.48 86.36,6.35 82.55,2.54 77.47,2.54 73.66,2.54 67.31,2.54 v57.15,2.54 52.07,2.54 46.99,2.54 41.91,2.54 36.83,2.54
  pour Top (isolate 0.305, rank 3, no thermals): 14.99,37.47 14.99,38.61 14.61,38.99 14.61,44.07 16,45.47 16.51,44.96 16.51,39.62 15.49,38.61 15.49,37.47
VPRG_IN  (via drill 0.51)
  Top 0.254: U4.13 70.2,21.23 | 70.2,21.23 68.96,22.48 68.96,23.24 70.23,24.51 70.23,27.56 v70.61,27.94 | U5.36 45.86,27.42 46.1,27.18 49.66,27.18 v49.78,27.05 | v57.66,21.21 57.53,21.08 57.53,20.83 61.85,16.51 64.77,16.51 66.8,18.54 v69.85,18.54 | v69.72,20.57 69.72,20.75 70.2,21.23 | JP7.7 67.94,36.83 68.45,36.32 68.45,31.24 68.96,30.73 68.96,28.07 v68.83,27.94
  Bottom 0.254: v70.61,27.94 v68.83,27.94 | v57.66,21.21 57.28,21.59 57.28,22.73 54.36,25.65 50.42,25.65 49.78,26.29 v49.78,27.05 | v69.85,18.54 69.72,18.67 v69.72,20.57
VPRG_OUT  (via drill 0.51)
  Top 0.254: U1.6 38.08,56.88 37.85,56.64 v36.32,56.64 | U3.6 46.21,19.32 46.61,18.92 48.51,18.92 49.15,19.56 49.15,24.26 50.67,25.78 59.05,25.78 v59.56,26.29 | v36.83,50.16 37.72,49.28 38.48,49.28 39.24,50.04 47.88,50.04 48.77,49.15 48.96,48.96 49.78,48.13 51.56,48.13 51.94,48.51 58.67,48.51 63.63,43.56 74.68,43.56 75.69,42.55 75.69,38.48 77.34,36.83 JP15.9 | U4.7 64.86,21.89 62.48,24.26 62.48,25.27 | v62.1,36.83 62.48,36.45 62.48,28.45 61.59,27.56 61.59,26.8 62.48,25.91 62.48,25.27 | v61.85,25.27 62.48,25.27 | U2.6 77.32,56.15 v78.36,55.12
  Bottom 0.254: v36.32,56.64 36.32,52.2 36.45,52.07 36.45,50.55 v36.83,50.16 | v78.36,55.12 79.25,55.12 84.07,50.29 84.07,38.35 81.28,35.56 78.99,35.56 77.72,36.83 JP15.9 76.58,35.94 67.69,35.94 66.95,36.68 JP8.8 v62.1,36.83 | v61.85,25.27 61.34,25.27 60.33,26.29 v59.56,26.29
XERR  (via drill 0.51, 0.51 pad 0.41)
  Top 0.254: U1.23 47.35,56.88 v47.62,57.15 | U3.23 35.2,19.32 v34.92,19.05 | U2.23 67.04,56.15 66.42,56.77 65.66,56.77 65.15,56.26 65.15,55.5 v64.9,55.24 | v58.42,54.48 55.37,54.48 52.45,51.56 51.82,51.56 v51.44,51.18 | JP8.11 v71.12,31.75 | v35.56,23.88 35.56,25.02 36.2,25.65 45.85,25.65 46.86,24.64 47.5,24.64 47.88,25.02 49.15,25.02 50.42,26.29 50.67,26.29 | 50.67,30.93 U5.42 50.67,30.92 50.67,26.29 | 50.67,26.29 58.04,26.29 60.96,29.21 60.96,32.51 v60.58,32.89 60.96,33.27 60.96,35.18 59.82,36.32 R8.2 59.18,36.41 v59.18,38.35 | v58.29,40.89 58.29,41.15 56.9,42.55 56.9,43.43 55.12,45.21 52.58,45.21 v51.56,46.23
  Bottom 0.254: v47.62,57.15 47.62,55.88 46.74,54.99 46.74,54.1 48.64,52.2 50.42,52.2 v51.44,51.18 51.56,51.05 v51.56,46.23 | v34.92,19.05 34.92,23.24 v35.56,23.88 | v64.9,55.24 64.26,54.61 60.33,54.61 60.07,54.36 58.55,54.36 v58.42,54.48 | v60.58,32.89 69.98,32.89 v71.12,31.75 JP8.11 73.91,31.75 74.68,32.51 75.56,32.51 76.07,33.02 78.11,33.02 79.38,31.75 JP15.14 | v59.18,38.35 59.18,40.01 v58.29,40.89
XLAT_IN  (via drill 0.51)
  Top 0.254: U4.15 70.17,22.54 v69.85,22.86 | v68.2,24.51 67.94,24.77 67.94,28.57 65.53,30.99 65.53,37.95 JP7.5 v68.71,39.37 | U5.13 51.44,42.76 51.44,43.18 51.82,43.56 54.23,43.56 56.64,41.15 v57.02,41.15
  Bottom 0.254: v69.85,22.86 v68.2,24.51 | v57.02,41.15 57.66,41.78 58.67,41.78 59.18,41.27 59.18,40.77 60.58,39.37 60.83,39.37 61.98,38.23 67.82,38.23 68.71,39.12 v68.71,39.37
XLAT_OUT  (via drill 0.51)
  Top 0.254: U1.3 38.17,58.86 37.72,59.31 36.58,59.31 v36.2,59.69 | U3.3 43.63,17.34 43.69,17.4 49.28,17.4 50.67,18.8 50.67,23.5 51.44,24.26 56.77,24.26 59.94,21.08 62.87,21.08 v63.25,21.46 | U2.3 74.86,54.17 74.93,54.1 77.47,54.1 v77.72,53.85 | v35.56,50.16 36.96,48.77 38.73,48.77 39.5,49.53 47.62,49.53 49.53,47.62 51.82,47.62 52.2,48.01 58.42,48.01 63.37,43.05 74.3,43.05 74.55,42.8 74.55,38.73 v74.42,38.61 | v65.15,39.24 65.02,39.12 65.02,30.73 67.31,28.45 67.31,23.75 66.75,23.18 U4.5 66.98,23.18 v67.44,22.73
  Bottom 0.254: v36.2,59.69 34.92,58.42 34.92,52.07 34.67,51.82 34.67,51.05 v35.56,50.16 | v77.72,53.85 78.61,52.96 79.88,52.96 83.06,49.78 83.06,40.01 81.15,38.1 78.99,38.1 77.72,39.37 JP15.7 76.58,38.48 74.42,38.48 | 74.42,38.48 v74.42,38.61 74.3,38.48 | v65.15,39.24 66.83,39.24 JP8.6 66.95,39.34 67.87,40.26 69.09,40.26 69.85,39.5 69.85,38.99 70.36,38.48 74.42,38.48 | v63.25,21.46 66.17,21.46 v67.44,22.73

### Text on the board
Bottom: DEC-2012
tPlace: RESET | VIN | LED0-11 | LED12-23 | GND | LightHouse-v01 | DAISY-CHAIN | LED36-47 | LED24-35 | ETH PORT | JTAG